# Altium project МЦТР.00010528.00.001.PrjPcb
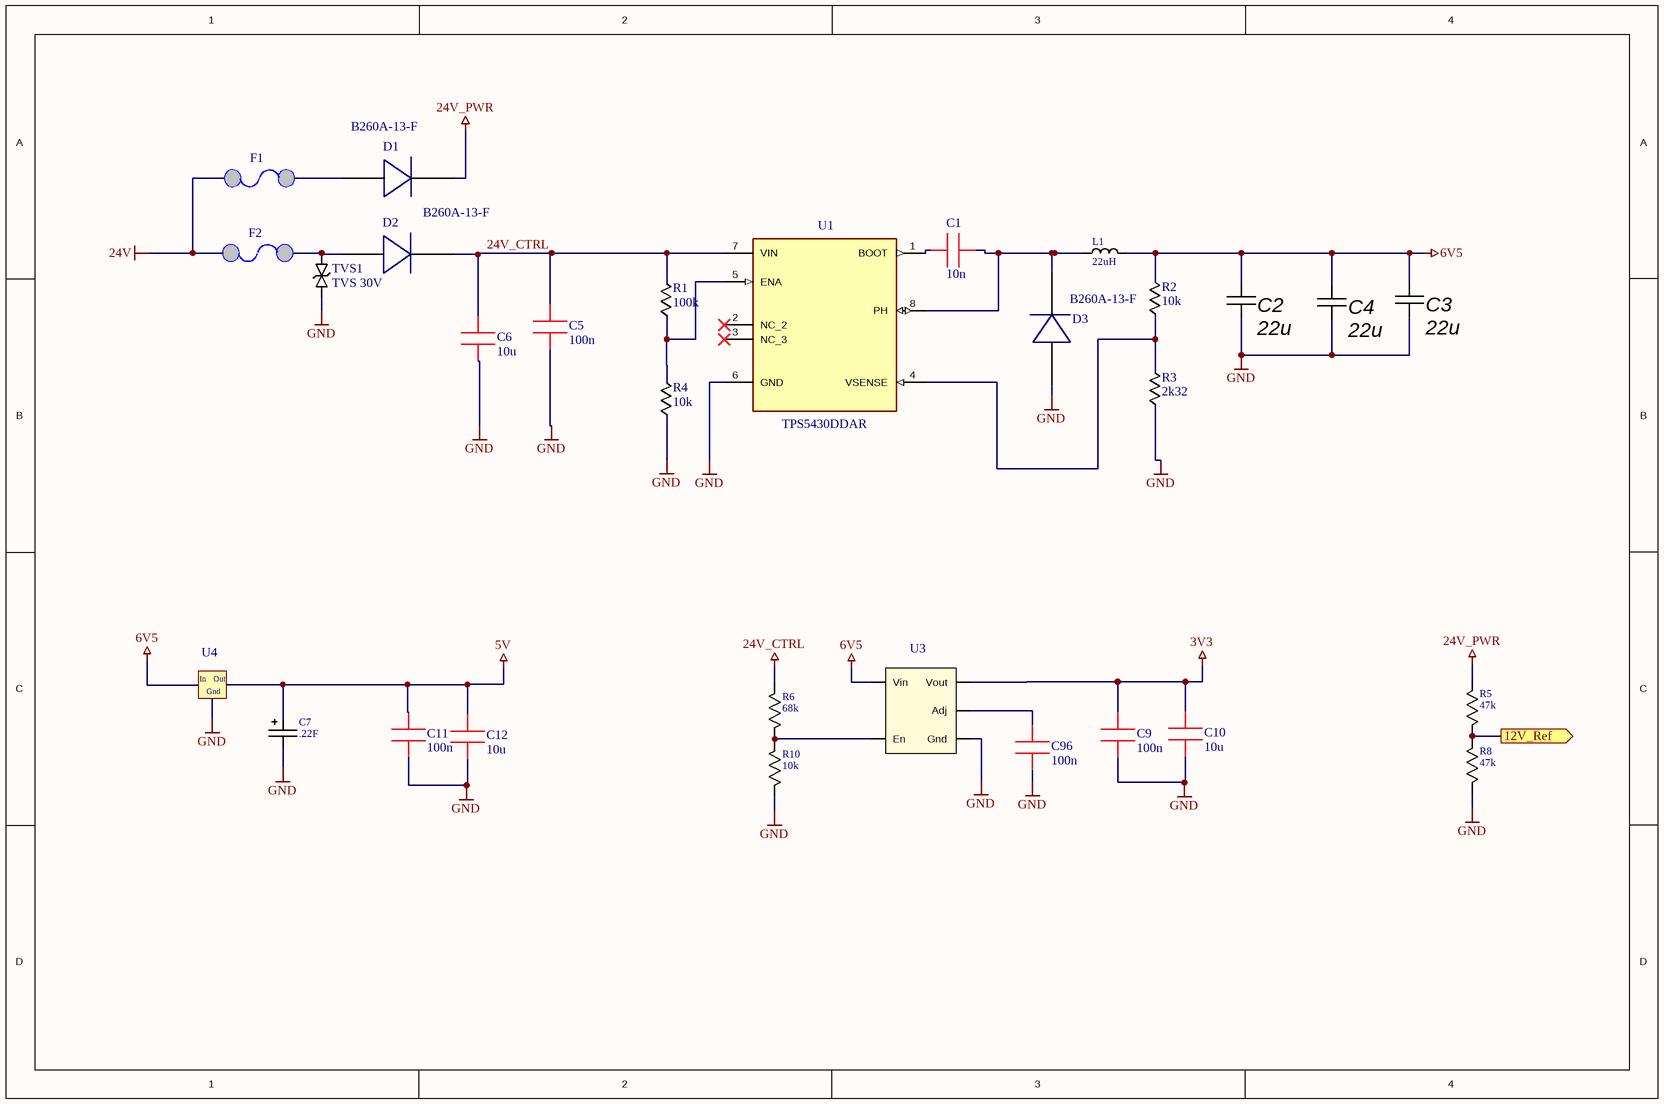
[diagram p0: PSU.SchDoc]
13 sheets, 342 parts. Net scope: global (net labels, ports and power ports of the same name join across sheets).
Board file: 讨倚.00010528.00.001.PcbDoc
Sheets:
  PSU.SchDoc
  MCU.SchDoc
  FRAM.SchDoc
  RTC.SchDoc
  CT Main.SchDoc
  DI 220V DC.SchDoc
  PT100.SchDoc
  4-20.SchDoc
  Encoder NPN.SchDoc
  RS485.SchDoc
  Ethernet.SchDoc
  LEDs.SchDoc
  Plugs.SchDoc

## Sheet PSU.SchDoc
size A4

### Parts
C1  10n  [0603]
C2  22u  [0805]
C3  22u  [0805]
C4  22u  [0805]
C5  100n  [0603]
C6  10u  [1210]
C7  .22F  [Supercap -D20-V]
C9  100n  [0603]
C10  10u  [0603]
C11  100n  [0603]
C12  10u  [0603]
C96  100n  [0603]
D1  B260A-13-F  [DO-214Pol]
D2  B260A-13-F  [DO-214Pol]
D3  B260A-13-F  [DO-214Pol]
F1  Resettable FUSE  [1812]  (value not drawn)
F2  Resettable FUSE  [1812]  (value not drawn)
L1  22uH  [CDRH127]
R1  100k  [0603]
R2  10k  [0603]
R3  2k32  [0603]
R4  10k  [0603]
R5  47k  [RES 0603]
R6  68k  [RES 0603]
R8  47k  [RES 0603]
R10  10k  [RES 0603]
TVS1  TVS 30V  [DO-214AC]
U1  TPS5430DDAR  [SOIC-8 + Thermal Pad]
U3  LDO with Enable Pin  [SOT-23-5]  (value not drawn)
U4  LDO 5V  [SOT223]  (value not drawn)

### Ports
12V_Ref

### Nets
3V3: C9.1 C10.1 U3.5(Vout)
5V: C7.2 C11.1 C12.1 U4.2(OUT)
6V5: C2.2 C3.2 C4.2 L1.2 R2.2 U3.1(Vin) U4.3(IN)
24V: F1.2 F2.2
24V_CTRL: C5.2 C6.1 D2.1 R1.2 R6.1 U1.7(VIN)
24V_PWR: D1.1 R5.1
GND: C2.1 C3.1 C4.1 C5.1 C6.2 C7.1 C9.2 C10.2 C11.2 C12.2 C96.2 D3.2 R3.1 R4.1 R8.2 R10.2 TVS1.2 U1.6(GND) U3.2(Gnd) U4.1(GND)
12V_Ref: R5.2 R8.1 ; port 12V_Ref
NetC1_1: C1.1 D3.1 L1.1 U1.8(PH)
NetC1_2: C1.2 U1.1(BOOT)
NetC96_1: C96.1 U3.4(Adj)
NetD1_2: D1.2 F1.1
NetD2_2: D2.2 F2.1 TVS1.1
NetR1_1: R1.1 R4.2 U1.5(ENA)
NetR2_1: R2.1 R3.2 U1.4(VSENSE)
NetR6_2: R6.2 R10.1 U3.3(En)

Not connected (* = marked no-connect by the designer): U1 2(NC_2)* 3(NC_3)*

### Notes on the sheet
- (in symbol ldo) In; Out; Gnd

### Library data of the parts
C1 = 0603 CAP: CC0603JRX7R9BB103
C2-C4 = Capacitor: CC0805MKX5R6BB226; Value: 100 нФ; Type: Конденсатор ЧИП; Power/Voltage: 50В; Tolerance: 10%; Name: 0805
C5 C9 C11 C96 = 0603 CAP: CC0603KRX7R9BB104
C6 = 1206 Cap: GRM32ER71H106KA12L
C7 = Capacitor Polar: 5R5D10F33V; pin to pad: 1>2 2>1
C10 C12 = 0603 CAP: GRM188R61C106MA73D
F1 F2 = Fuse PTS: MF-MSMF030-2
L1 = Inductor CDRH127: CDRH127/LDNP-220MC; Value: 22uH
R1 = 0603 RES: RC0603FR-07100KL
R2 R4 = 0603 RES: RC0603FR-0710KL
R3 = 0603 RES: RC0603FR-072K32L
R5 R8 = Resistor: RC0603FR-0747KL
R6 = Resistor: RC0603JR-0768KL
R10 = Resistor: RC0603FR-0710KL
TVS1 = TVS: SMAJ30CA
U3 = LM8805: LM8805SF5-3.3
U4 = ldo: LD1117S50CTR

## Sheet MCU.SchDoc
size A4
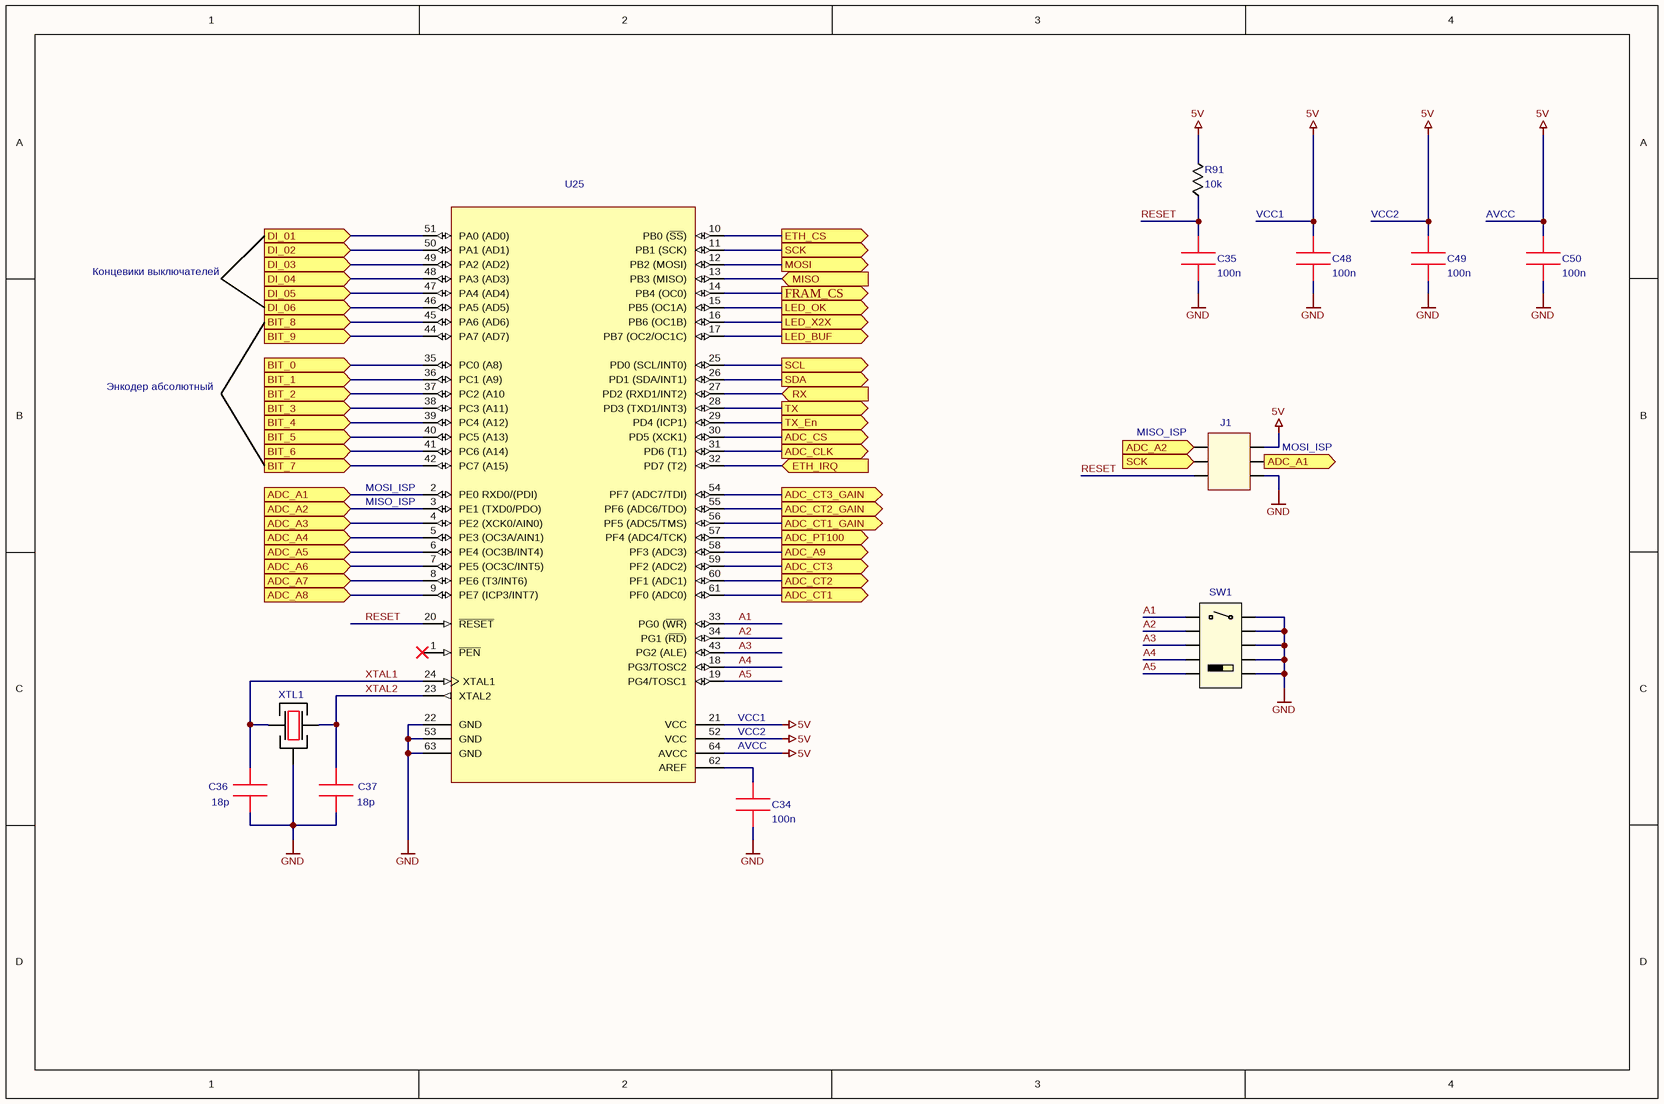
[diagram p1: MCU.SchDoc]

### Parts
C34  100n  [0603]
C35  100n  [0603]
C36  18p  [0603]
C37  18p  [0603]
C48  100n  [0603]
C49  100n  [0603]
C50  100n  [0603]
J1  Pin Line 2x3  [PLD-6 2.54]  (value not drawn)
R91  10k  [0603]
SW1  DIP-Switch 5 Pins  [Switch DIP-5]  (value not drawn)
U25  MCU  [64A_N]  (value not drawn)
XTL1  16.0 MHz  [ABM10]  (value not drawn)

### Ports
ADC_A1, ADC_A2, ADC_A3, ADC_A4, ADC_A5, ADC_A6, ADC_A7, ADC_A8, ADC_A9, ADC_CLK, ADC_CS, ADC_CT1, ADC_CT1_GAIN, ADC_CT2, ADC_CT2_GAIN, ADC_CT3, ADC_CT3_GAIN, ADC_PT100, BIT_0, BIT_1, BIT_2, BIT_3, BIT_4, BIT_5, BIT_6, BIT_7, BIT_8, BIT_9, DI_01, DI_02, DI_03, DI_04, DI_05, DI_06, ETH_CS, ETH_IRQ, FRAM_CS, LED_BUF, LED_OK, LED_X2X, MISO, MOSI, RX, SCK, SCL, SDA, TX, TX_En

### Nets
5V: C48.2 C49.2 C50.2 J1.2 R91.2 U25.21(VCC) U25.52(VCC) U25.64(AVCC)
GND: C34.1 C35.1 C36.1 C37.1 C48.1 C49.1 C50.1 J1.6 SW1.1 SW1.3 SW1.5 SW1.7 SW1.9 U25.22(GND) U25.53(GND) U25.63(GND) XTL1.2
A1: SW1.2 U25.33(PG0_(~{WR}))
A2: SW1.4 U25.34(PG1_(~{RD}))
A3: SW1.6 U25.43(PG2_(ALE))
A4: SW1.8 U25.18(PG3/TOSC2)
A5: SW1.10 U25.19(PG4/TOSC1)
ADC_A1: J1.4 U25.2(PE0_RXD0/(PDI)) ; port ADC_A1
ADC_A2: J1.1 U25.3(PE1_(TXD0/PDO)) ; port ADC_A2
ADC_A3: U25.4(PE2_(XCK0/AIN0)) ; port ADC_A3
ADC_A4: U25.5(PE3_(OC3A/AIN1)) ; port ADC_A4
ADC_A5: U25.6(PE4_(OC3B/INT4)) ; port ADC_A5
ADC_A6: U25.7(PE5_(OC3C/INT5)) ; port ADC_A6
ADC_A7: U25.8(PE6_(T3/INT6)) ; port ADC_A7
ADC_A8: U25.9(PE7_(ICP3/INT7)) ; port ADC_A8
ADC_A9: U25.58(PF3_(ADC3)) ; port ADC_A9
ADC_CLK: U25.31(PD6_(T1)) ; port ADC_CLK
ADC_CS: U25.30(PD5_(XCK1)) ; port ADC_CS
ADC_CT1: U25.61(PF0_(ADC0)) ; port ADC_CT1
ADC_CT1_GAIN: U25.56(PF5_(ADC5/TMS)) ; port ADC_CT1_GAIN
ADC_CT2: U25.60(PF1_(ADC1)) ; port ADC_CT2
ADC_CT2_GAIN: U25.55(PF6_(ADC6/TDO)) ; port ADC_CT2_GAIN
ADC_CT3: U25.59(PF2_(ADC2)) ; port ADC_CT3
ADC_CT3_GAIN: U25.54(PF7_(ADC7/TDI)) ; port ADC_CT3_GAIN
ADC_PT100: U25.57(PF4_(ADC4/TCK)) ; port ADC_PT100
BIT_0: U25.35(PC0_(A8)) ; port BIT_0
BIT_1: U25.36(PC1_(A9)) ; port BIT_1
BIT_2: U25.37(PC2_(A10) ; port BIT_2
BIT_3: U25.38(PC3_(A11)) ; port BIT_3
BIT_4: U25.39(PC4_(A12)) ; port BIT_4
BIT_5: U25.40(PC5_(A13)) ; port BIT_5
BIT_6: U25.41(PC6_(A14)) ; port BIT_6
BIT_7: U25.42(PC7_(A15)) ; port BIT_7
BIT_8: U25.45(PA6_(AD6)) ; port BIT_8
BIT_9: U25.44(PA7_(AD7)) ; port BIT_9
DI_01: U25.51(PA0_(AD0)) ; port DI_01
DI_02: U25.50(PA1_(AD1)) ; port DI_02
DI_03: U25.49(PA2_(AD2)) ; port DI_03
DI_04: U25.48(PA3_(AD3)) ; port DI_04
DI_05: U25.47(PA4_(AD4)) ; port DI_05
DI_06: U25.46(PA5_(AD5)) ; port DI_06
ETH_CS: U25.10(PB0_(~{SS})) ; port ETH_CS
ETH_IRQ: U25.32(PD7_(T2)) ; port ETH_IRQ
FRAM_CS: U25.14(PB4_(OC0)) ; port FRAM_CS
LED_BUF: U25.17(PB7_(OC2/OC1C)) ; port LED_BUF
LED_OK: U25.15(PB5_(OC1A)) ; port LED_OK
LED_X2X: U25.16(PB6_(OC1B)) ; port LED_X2X
MISO: U25.13(PB3_(MISO)) ; port MISO
MOSI: U25.12(PB2_(MOSI)) ; port MOSI
RESET: C35.2 J1.5 R91.1 U25.20(~{RESET})
RX: U25.27(PD2_(RXD1/INT2)) ; port RX
SCK: J1.3 U25.11(PB1_(SCK)) ; port SCK
SCL: U25.25(PD0_(SCL/INT0)) ; port SCL
SDA: U25.26(PD1_(SDA/INT1)) ; port SDA
TX: U25.28(PD3_(TXD1/INT3)) ; port TX
TX_En: U25.29(PD4_(ICP1)) ; port TX_En
XTAL1: C36.2 U25.24(XTAL1) XTL1.1
XTAL2: C37.2 U25.23(XTAL2) XTL1.3
NetC34_2: C34.2 U25.62(AREF)

Not connected (* = marked no-connect by the designer): U25 1(~{PEN})*

### Notes on the sheet
- VCC1
- VCC2
- AVCC
- Концевики выключателей
- Энкодер абсолютный
- (near J1) MISO_ISP
- (near J1) MOSI_ISP
- (near U25) MOSI_ISP
- (near U25) MISO_ISP
- (near U25) VCC1

### Library data of the parts
C34 C35 C48-C50 = 0603 CAP: CC0603KRX7R9BB104
C36 C37 = 0603 CAP: CC0603JRNPO9BN180
J1 = PLD-6
R91 = 0603 RES: RC0603FR-0710KL
SW1 = Switch DIP-5: DIP-Switch NDP-05
U25 = ATmega128A-AU: DatasheetVersion: revH, Feb-2011; PackageVersion: revC, Oct-2010; PackageReference: 64A; PackageDescription: 64-Pin Plastic Thin Profile Quad Flat Pack, 14 x 14 x 1.0 mm Body, 0.8 mm Pitch (TQFP); Code_JEDEC: MS-026-AEB; ComponentLink1Description: Manufacturer URL; ComponentLink1URL: http://www.atmel.com/; ComponentLink2Description: ATmega128A Datasheet; ComponentLink2URL: http://www.atmel.com/dyn/resources/prod_documents/doc8151.pdf; ComponentLink3Description: ATmega128A Summary; ComponentLink3URL: http://www.atmel.com/dyn/resources/prod_documents/8151S.pdf
XTL1 = KX-7: 12.88605

## Sheet FRAM.SchDoc
size A4; PageSetup: Record=PageOptions|CenterHorizontal=True|CenterVertical=True|PrintScale=0.99|XCorrection=1.00|YCorrection=1.00|PrintKind=1|BorderSize=5000000|LeftOffset=0|BottomOffset=0|Orientation=1|PaperLength=1000|PaperWidth=1000|Scale=100|PaperSource=15|PrintQuality=600|MediaType=1|DitherType=10|PrintScaleMode=1|PaperKind=A4|PaperIndex=9
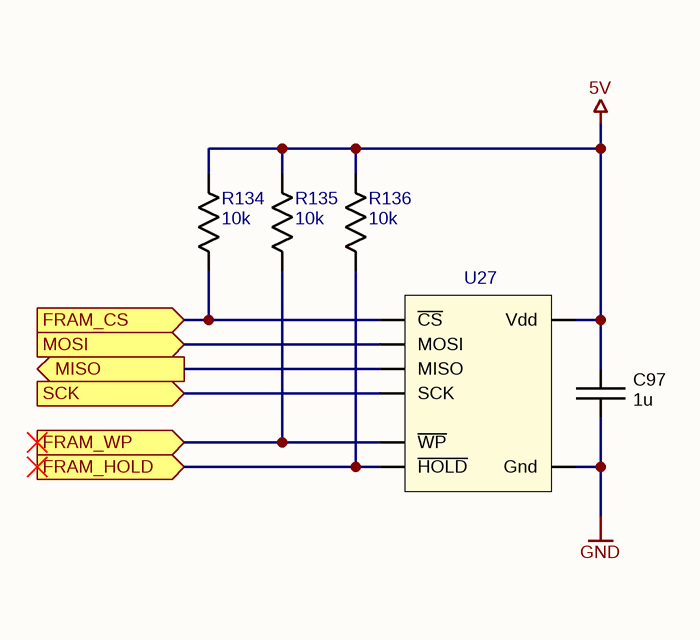
[diagram p2: FRAM.SchDoc]

### Parts
C97  1u  [CAP CER 0603 NP]
R134  10k  [RES 0603]
R135  10k  [RES 0603]
R136  10k  [RES 0603]
U27  FRAM SPI IC  [SOIC-8]  (value not drawn)

### Ports
FRAM_CS, FRAM_HOLD, FRAM_WP, MISO, MOSI, SCK

### Nets
5V: C97.1 R134.2 R135.2 R136.2 U27.8(Vdd)
GND: C97.2 U27.4(Gnd)
FRAM_CS: R134.1 U27.1(~{CS}) ; port FRAM_CS
FRAM_HOLD: R136.1 U27.7(~{HOLD}) ; port FRAM_HOLD
FRAM_WP: R135.1 U27.3(~{WP}) ; port FRAM_WP
MISO: U27.2(MISO) ; port MISO
MOSI: U27.5(MOSI) ; port MOSI
SCK: U27.6(SCK) ; port SCK

### Library data of the parts
C97 = Capacitor: CC0603KRX5R7BB105
R134-R136 = Resistor: RC0603FR-0710KL
U27 = MB85RS64V: MB85RS64VPNF-G-JNERE1

## Sheet RTC.SchDoc
size A4; PageSetup: Record=PageOptions|CenterHorizontal=True|CenterVertical=True|PrintScale=0.99|XCorrection=1.00|YCorrection=1.00|PrintKind=1|BorderSize=5000000|LeftOffset=0|BottomOffset=0|Orientation=1|PaperLength=1000|PaperWidth=1000|Scale=100|PaperSource=15|PrintQuality=600|MediaType=1|DitherType=10|PrintScaleMode=1|PaperKind=A4|PaperIndex=9
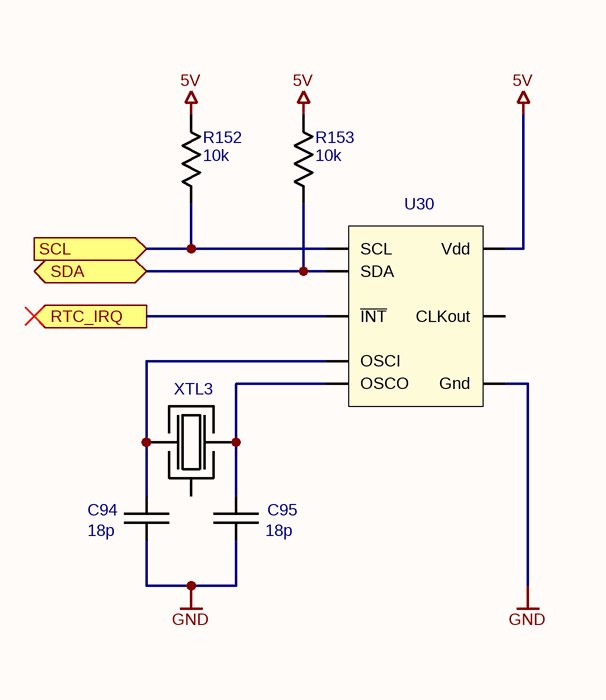
[diagram p3: RTC.SchDoc]

### Parts
C94  18p  [CAP CER 0603 NP]
C95  18p  [CAP CER 0603 NP]
R152  10k  [RES 0603]
R153  10k  [RES 0603]
U30  Real-Time Clock IC  [SOIC-8]  (value not drawn)
XTL3  32.768 kHz  [XTAL KX-327NHT]  (value not drawn)

### Ports
RTC_IRQ, SCL, SDA

### Nets
5V: R152.2 R153.2 U30.8(Vdd)
GND: C94.1 C95.1 U30.4(Gnd)
RTC_IRQ: U30.3(~{INT}) ; port RTC_IRQ
SCL: R152.1 U30.6(SCL) ; port SCL
SDA: R153.1 U30.5(SDA) ; port SDA
NetC94_2: C94.2 U30.1(OSCI) XTL3.1
NetC95_2: C95.2 U30.2(OSCO) XTL3.3

Not connected (* = marked no-connect by the designer): U30 7(CLKout); XTL3 2

### Library data of the parts
C94 C95 = Capacitor: CC0603JRNPO9BN180
R152 R153 = Resistor: RC0603FR-0710KL
U30 = PCF8653: PCF8563T/5,518
XTL3 = Quartz Resonator: 12.87150

## Sheet CT Main.SchDoc
size A3
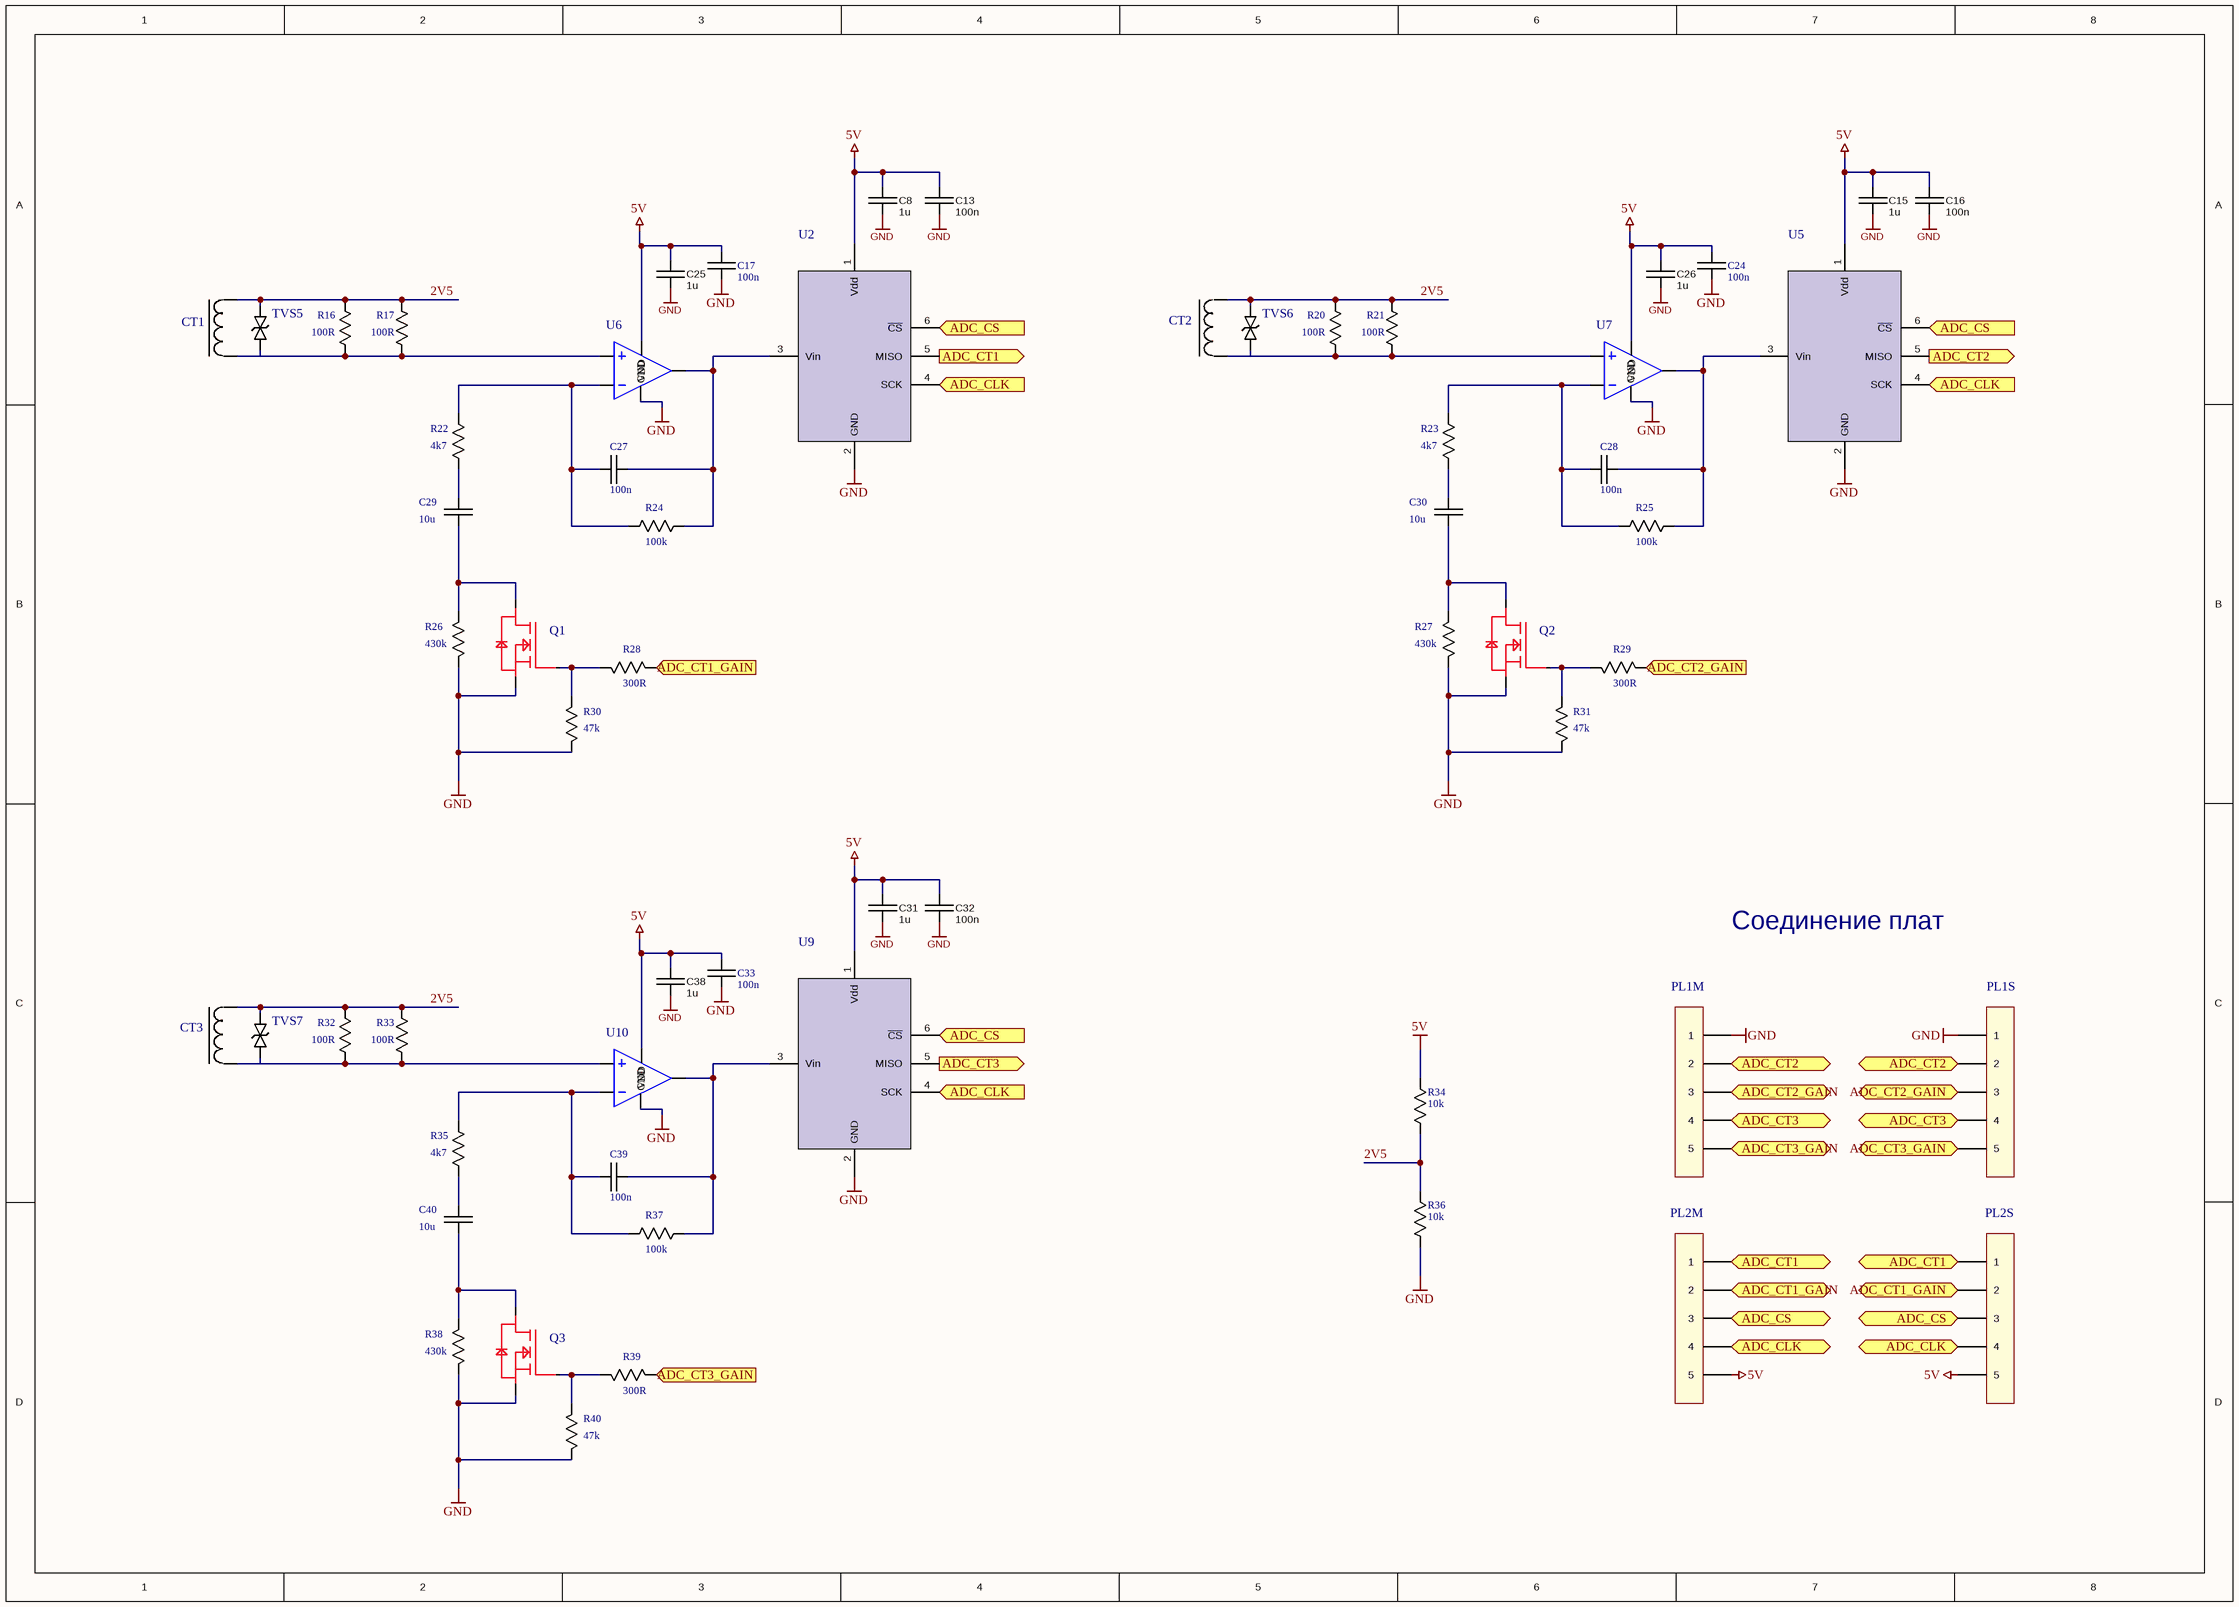
[diagram p4: CT Main.SchDoc]

### Parts
C8  1u  [CAP CER 0603 NP]
C13  100n  [CAP CER 0603 NP]
C15  1u  [CAP CER 0603 NP]
C16  100n  [CAP CER 0603 NP]
C17  100n  [0603]
C24  100n  [0603]
C25  1u  [CAP CER 0603 NP]
C26  1u  [CAP CER 0603 NP]
C27  100n  [0603]
C28  100n  [0603]
C29  10u  [0603]
C30  10u  [0603]
C31  1u  [CAP CER 0603 NP]
C32  100n  [CAP CER 0603 NP]
C33  100n  [0603]
C38  1u  [CAP CER 0603 NP]
C39  100n  [0603]
C40  10u  [0603]
CT1  Current Transformer  [Talema AC1005]  (value not drawn)
CT2  Current Transformer  [Talema AC1005]  (value not drawn)
CT3  Current Transformer  [Talema AC1005]  (value not drawn)
PL1M  Pin Line  [PLS-5 2.54]  (value not drawn)
PL1S  Pin Line  [PLS-5 2.54]  (value not drawn)
PL2M  Pin Line  [PLS-5 2.54]  (value not drawn)
PL2S  Pin Line  [PLS-5 2.54]  (value not drawn)
Q1  MOSFET-N  [SOT23]  (value not drawn)
Q2  MOSFET-N  [SOT23]  (value not drawn)
Q3  MOSFET-N  [SOT23]  (value not drawn)
R16  100R  [1206]
R17  100R  [1206]
R20  100R  [1206]
R21  100R  [1206]
R22  4k7  [0603]
R23  4k7  [0603]
R24  100k  [0603]
R25  100k  [0603]
R26  430k  [0603]
R27  430k  [0603]
R28  300R  [0603]
R29  300R  [0603]
R30  47k  [0603]
R31  47k  [0603]
R32  100R  [1206]
R33  100R  [1206]
R34  10k  [0603]
R35  4k7  [0603]
R36  10k  [0603]
R37  100k  [0603]
R38  430k  [0603]
R39  300R  [0603]
R40  47k  [0603]
TVS5  TVS 5V  [DO-214AC]  (value not drawn)
TVS6  TVS 5V  [DO-214AC]  (value not drawn)
TVS7  TVS 5V  [DO-214AC]  (value not drawn)
U2  SAR ADC  [SOT23 - 6]  (value not drawn)
U5  SAR ADC  [SOT23 - 6]  (value not drawn)
U6  TS321ILT  [SOT235]  (value not drawn)
U7  TS321ILT  [SOT235]  (value not drawn)
U9  SAR ADC  [SOT23 - 6]  (value not drawn)
U10  TS321ILT  [SOT235]  (value not drawn)

### Ports
ADC_CLK, ADC_CS, ADC_CT1, ADC_CT1_GAIN, ADC_CT2, ADC_CT2_GAIN, ADC_CT3, ADC_CT3_GAIN

### Nets
5V: C8.1 C13.2 C15.1 C16.2 C17.2 C24.2 C25.1 C26.1 C31.1 C32.2 C33.2 C38.1 PL2M.5 PL2S.5 R34.1 U2.1(Vdd) U5.1(Vdd) U6.5(VDD) U7.5(VDD) U9.1(Vdd) U10.5(VDD)
GND: C8.2 C13.1 C15.2 C16.1 C17.1 C24.1 C25.2 C26.2 C31.2 C32.1 C33.1 C38.2 PL1M.1 PL1S.1 Q1.2 Q2.2 Q3.2 R26.1 R27.1 R30.1 R31.1 R36.2 R38.1 R40.1 U2.2(GND) U5.2(GND) U6.2(GND) U7.2(GND) U9.2(GND) U10.2(GND)
2V5: CT1.2 CT2.2 CT3.2 R16.2 R17.2 R20.2 R21.2 R32.2 R33.2 R34.2 R36.1 TVS5.2 TVS6.2 TVS7.2
ADC_CLK: PL2M.4 PL2S.4 U2.4(SCK) U5.4(SCK) U9.4(SCK) ; port ADC_CLK
ADC_CS: PL2M.3 PL2S.3 U2.6(~{CS}) U5.6(~{CS}) U9.6(~{CS}) ; port ADC_CS
ADC_CT1: PL2M.1 PL2S.1 U2.5(MISO) ; port ADC_CT1
ADC_CT1_GAIN: PL2M.2 PL2S.2 R28.1 ; port ADC_CT1_GAIN
ADC_CT2: PL1M.2 PL1S.2 U5.5(MISO) ; port ADC_CT2
ADC_CT2_GAIN: PL1M.3 PL1S.3 R29.1 ; port ADC_CT2_GAIN
ADC_CT3: PL1M.4 PL1S.4 U9.5(MISO) ; port ADC_CT3
ADC_CT3_GAIN: PL1M.5 PL1S.5 R39.1 ; port ADC_CT3_GAIN
NetC27_1: C27.1 R22.2 R24.1 U6.4(-IN)
NetC27_2: C27.2 R24.2 U2.3(Vin) U6.1(OUT)
NetC28_1: C28.1 R23.2 R25.1 U7.4(-IN)
NetC28_2: C28.2 R25.2 U5.3(Vin) U7.1(OUT)
NetC29_1: C29.1 Q1.3 R26.2
NetC29_2: C29.2 R22.1
NetC30_1: C30.1 Q2.3 R27.2
NetC30_2: C30.2 R23.1
NetC39_1: C39.1 R35.2 R37.1 U10.4(-IN)
NetC39_2: C39.2 R37.2 U9.3(Vin) U10.1(OUT)
NetC40_1: C40.1 Q3.3 R38.2
NetC40_2: C40.2 R35.1
NetCT1_1: CT1.1 R16.1 R17.1 TVS5.1 U6.3(+IN)
NetCT2_1: CT2.1 R20.1 R21.1 TVS6.1 U7.3(+IN)
NetCT3_1: CT3.1 R32.1 R33.1 TVS7.1 U10.3(+IN)
NetQ1_1: Q1.1 R28.2 R30.2
NetQ2_1: Q2.1 R29.2 R31.2
NetQ3_1: Q3.1 R39.2 R40.2

### Notes on the sheet
- Соединение плат

### Library data of the parts
C8 C15 C25 C26 C31 C38 = Capacitor: CC0603KRX5R7BB105
C13 C16 C17 C24 C27 C28 C32 C33 C39 = Capacitor: CC0603KRX7R9BB104
C29 C30 C40 = Capacitor: GRM188R61C106MA73D
CT1-CT3 = Current Trans: AC-1005
PL1M PL1S PL2M PL2S = PLS-5: PLS-5 2.54
Q1-Q3 = IRLML: IRLML2502TR
R16 R17 R20 R21 R32 R33 = Resistor: RT1206BRD07100RL
R22 R23 R35 = Resistor: RC0603FR-074K7L
R24 R25 R37 = Resistor: RC0603FR-07100KL
R26 R27 R38 = Resistor: RC0603FR-07430KL
R28 R29 R39 = Resistor: RC0603FR-07300RL
R30 R31 R40 = Resistor: RC0603FR-0747KL
R34 R36 = Resistor: RC0603FR-0710KL
TVS5-TVS7 = SMAJ5.0CA
U2 U5 U9 = ADC121: ADC121S021CIMF
U6 U7 U10 = OPAMP

## Sheet DI 220V DC.SchDoc
size A4
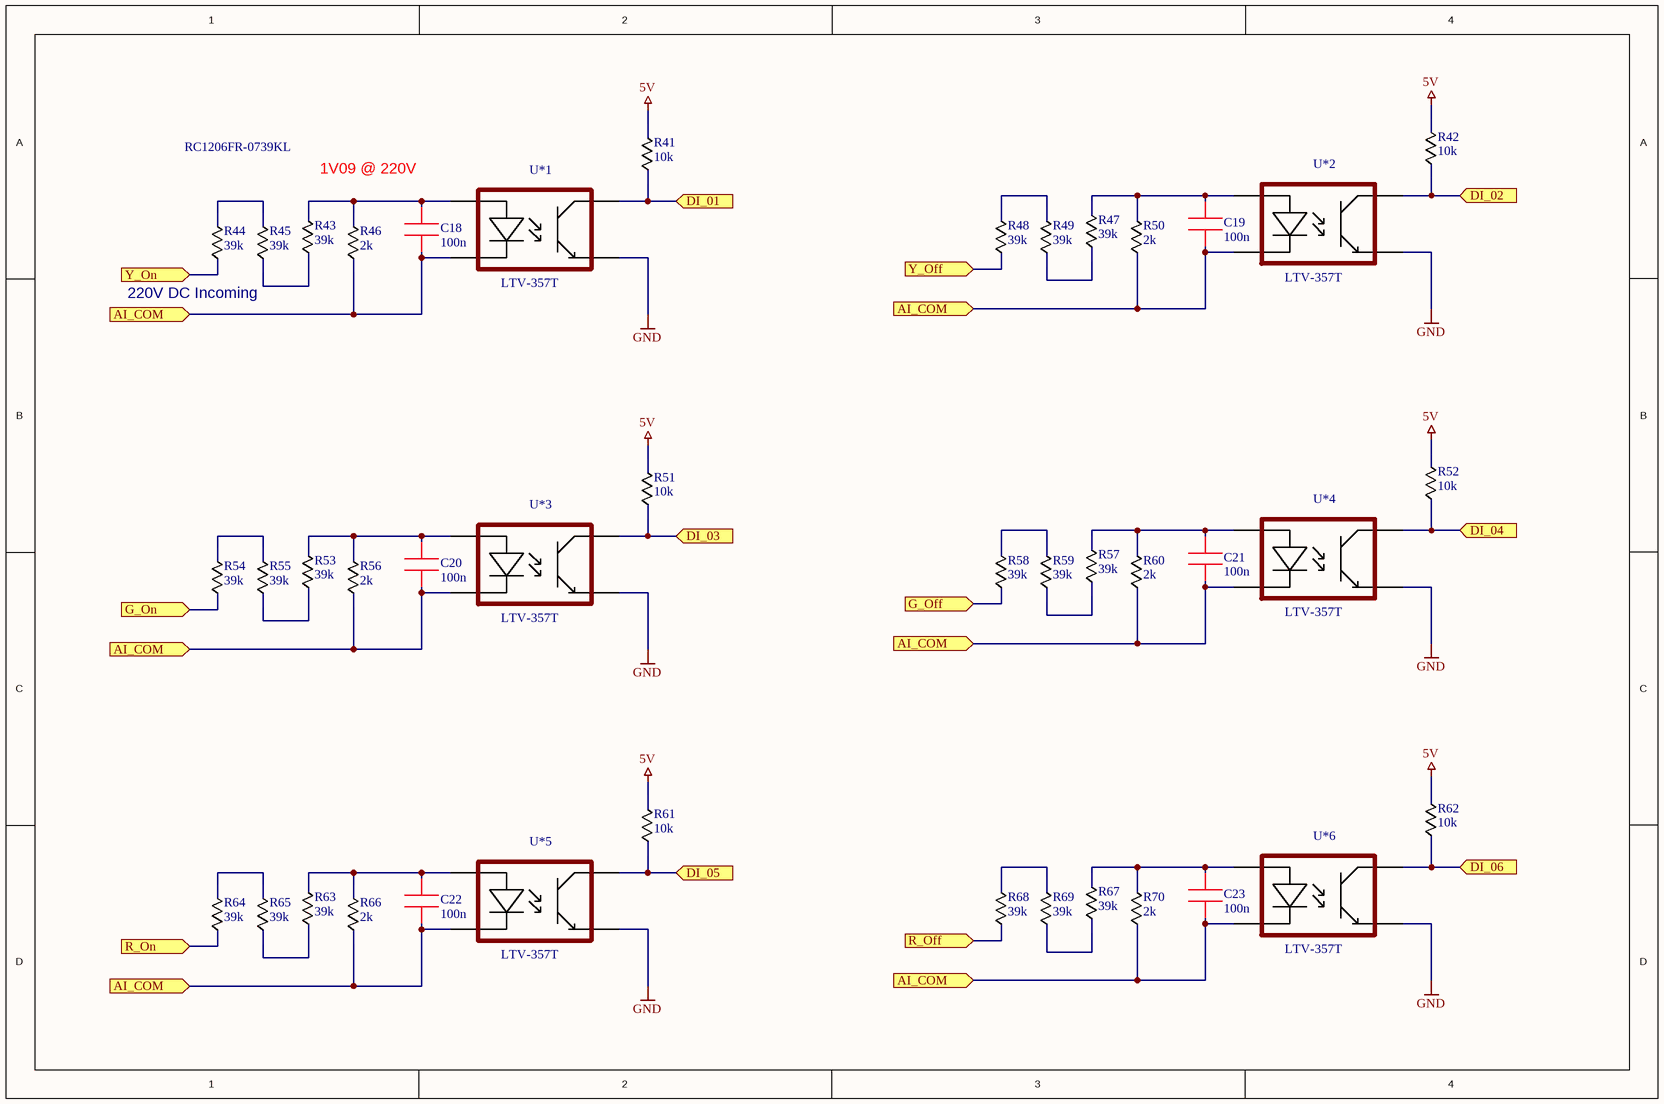
[diagram p5: DI 220V DC.SchDoc]

### Parts
C18  100n  [0603]
C19  100n  [0603]
C20  100n  [0603]
C21  100n  [0603]
C22  100n  [0603]
C23  100n  [0603]
R41  10k  [0603]
R42  10k  [0603]
R43  39k  [1206]
R44  39k  [1206]
R45  39k  [1206]
R46  2k  [1206]
R47  39k  [1206]
R48  39k  [1206]
R49  39k  [1206]
R50  2k  [1206]
R51  10k  [0603]
R52  10k  [0603]
R53  39k  [1206]
R54  39k  [1206]
R55  39k  [1206]
R56  2k  [1206]
R57  39k  [1206]
R58  39k  [1206]
R59  39k  [1206]
R60  2k  [1206]
R61  10k  [0603]
R62  10k  [0603]
R63  39k  [1206]
R64  39k  [1206]
R65  39k  [1206]
R66  2k  [1206]
R67  39k  [1206]
R68  39k  [1206]
R69  39k  [1206]
R70  2k  [1206]
U*1  LTV-357T  [SOP-4]
U*2  LTV-357T  [SOP-4]
U*3  LTV-357T  [SOP-4]
U*4  LTV-357T  [SOP-4]
U*5  LTV-357T  [SOP-4]
U*6  LTV-357T  [SOP-4]

### Ports
AI_COM, DI_01, DI_02, DI_03, DI_04, DI_05, DI_06, G_Off, G_On, R_Off, R_On, Y_Off, Y_On

### Nets
5V: R41.2 R42.2 R51.2 R52.2 R61.2 R62.2
GND: U*1.Emmiter(E) U*2.Emmiter(E) U*3.Emmiter(E) U*4.Emmiter(E) U*5.Emmiter(E) U*6.Emmiter(E)
AI_COM: C18.1 C19.1 C20.1 C21.1 C22.1 C23.1 R46.1 R50.1 R56.1 R60.1 R66.1 R70.1 U*1.Cathode(C) U*2.Cathode(C) U*3.Cathode(C) U*4.Cathode(C) U*5.Cathode(C) U*6.Cathode(C) ; port AI_COM
DI_01: R41.1 U*1.Collector(C) ; port DI_01
DI_02: R42.1 U*2.Collector(C) ; port DI_02
DI_03: R51.1 U*3.Collector(C) ; port DI_03
DI_04: R52.1 U*4.Collector(C) ; port DI_04
DI_05: R61.1 U*5.Collector(C) ; port DI_05
DI_06: R62.1 U*6.Collector(C) ; port DI_06
G_Off: R58.1 ; port G_Off
G_On: R54.1 ; port G_On
R_Off: R68.1 ; port R_Off
R_On: R64.1 ; port R_On
Y_Off: R48.1 ; port Y_Off
Y_On: R44.1 ; port Y_On
NetC18_2: C18.2 R43.2 R46.2 U*1.Anode(A)
NetC19_2: C19.2 R47.2 R50.2 U*2.Anode(A)
NetC20_2: C20.2 R53.2 R56.2 U*3.Anode(A)
NetC21_2: C21.2 R57.2 R60.2 U*4.Anode(A)
NetC22_2: C22.2 R63.2 R66.2 U*5.Anode(A)
NetC23_2: C23.2 R67.2 R70.2 U*6.Anode(A)
NetR43_1: R43.1 R45.1
NetR44_2: R44.2 R45.2
NetR47_1: R47.1 R49.1
NetR48_2: R48.2 R49.2
NetR53_1: R53.1 R55.1
NetR54_2: R54.2 R55.2
NetR57_1: R57.1 R59.1
NetR58_2: R58.2 R59.2
NetR63_1: R63.1 R65.1
NetR64_2: R64.2 R65.2
NetR67_1: R67.1 R69.1
NetR68_2: R68.2 R69.2

### Notes on the sheet
- RC1206FR-0739KL
- 1V09 @ 220V
- 220V DC Incoming

### Library data of the parts
C18-C23 = 0603 CAP: CC0603KRX7R9BB104
R41 R42 R51 R52 R61 R62 = 0603 RES: RC0603FR-0710KL
R43-R45 R47-R49 R53-R55 R57-R59 R63-R65 R67-R69 = 1206 R: RC1206FR-0739KL
R46 R50 R56 R60 R66 R70 = 1206 R: RC1206FR-072KL
U*1-U*6 = LTV-357T: pin to pad: Anode>1 Cathode>2 Collector>4 Emmiter>3

## Sheet PT100.SchDoc
size A4; PageSetup: Record=PageOptions|CenterHorizontal=True|CenterVertical=True|PrintScale=0.99|XCorrection=1.00|YCorrection=1.00|PrintKind=1|BorderSize=5000000|LeftOffset=0|BottomOffset=0|Orientation=1|PaperLength=1000|PaperWidth=1000|Scale=100|PaperSource=15|PrintQuality=600|MediaType=1|DitherType=10|PrintScaleMode=1|PaperKind=A4|PaperIndex=9
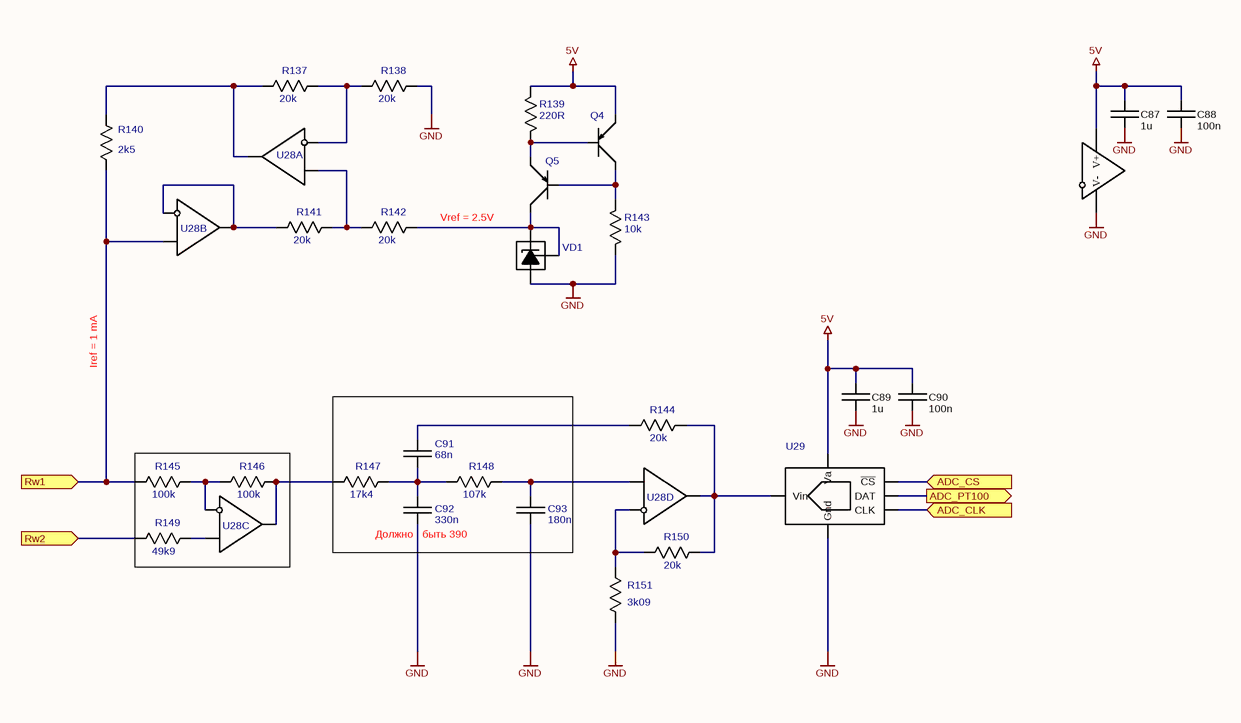
[diagram p6: PT100.SchDoc]

### Parts
C87  1u  [CAP CER 0603 NP]
C88  100n  [CAP CER 0603 NP]
C89  1u  [CAP CER 0603 NP]
C90  100n  [CAP CER 0603 NP]
C91  68n  [CAP CER 0603 NP]
C92  330n  [CAP CER 0603 NP]
C93  180n  [CAP CER 0603 NP]
Q4  PNP Bipolar Transistor  [SOT-23]  (value not drawn)
Q5  PNP Bipolar Transistor  [SOT-23]  (value not drawn)
R137  20k  [RES 0603]
R138  20k  [RES 0603]
R139  220R  [RES 0603]
R140  2k5  [RES 0603]
R141  20k  [RES 0603]
R142  20k  [RES 0603]
R143  10k  [RES 0603]
R144  20k  [RES 0603]
R145  100k  [RES 0603]
R146  100k  [RES 0603]
R147  17k4  [RES 0603]
R148  107k  [RES 0603]
R149  49k9  [RES 0603]
R150  20k  [RES 0603]
R151  3k09  [RES 0603]
U28  OpAmp x4 Small  [SOIC-14]  (value not drawn)  (parts A,B,C,D,E of 5)
U29  SAR ADC  [SOT-23-6]  (value not drawn)
VD1  Zenner Diode Adjustable  [SOT-23]  (value not drawn)

### Blocks framed on the sheet
Должно   быть 390: C91-C93 R147 R148

### Ports
ADC_CLK, ADC_CS, ADC_PT100, Rw1, Rw2

### Nets
5V: C87.1 C88.1 C89.1 C90.1 Q4.2(E) R139.2 U28.13(V+) U29.1(Va)
GND: C87.2 C88.2 C89.2 C90.2 C92.1 C93.1 R138.2 R143.1 R151.1 U28.14(V-) U29.2(Gnd) VD1.1(A)
ADC_CLK: U29.4(CLK) ; port ADC_CLK
ADC_CS: U29.6(~{CS}) ; port ADC_CS
ADC_PT100: U29.5(DAT) ; port ADC_PT100
Rw1: R140.1 R145.1 U28.4(+IN) ; port Rw1
Rw2: R149.1 ; port Rw2
NetC91_1: C91.1 C92.2 R147.2 R148.1
NetC91_2: C91.2 R144.1
NetC93_2: C93.2 R148.2 U28.10(+IN)
NetQ4_1: Q4.1(B) Q5.2(E) R139.1
NetQ4_3: Q4.3(C) Q5.1(B) R143.2
NetQ5_3: Q5.3(C) R142.2 VD1.2(C) VD1.3(Ref)
NetR137_1: R137.1 R140.2 U28.3(OUT1)
NetR137_2: R137.2 R138.1 U28.2(-IN1)
NetR141_1: R141.1 U28.5(-IN) U28.6(OUT)
NetR141_2: R141.2 R142.1 U28.1(+IN1)
NetR144_2: R144.2 R150.2 U28.12(OUT) U29.3(Vin)
NetR145_2: R145.2 R146.1 U28.8(-IN)
NetR146_2: R146.2 R147.1 U28.9(OUT)
NetR149_2: R149.2 U28.7(+IN)
NetR150_1: R150.1 R151.2 U28.11(-IN)

### Notes on the sheet
- Vref = 2.5V
- Iref = 1 mA

### Library data of the parts
C87 C89 = Capacitor: CC0603KRX5R7BB105
C88 C90 = Capacitor: CC0603KRX7R9BB104
C91 = Capacitor: CC0603JRX7R9BB683
C92 = Capacitor: CC0603KRX5R8BB334
C93 = Capacitor: GRM188R71E184KA88D
Q4 Q5 = Bipolar PNP: BC857
R137 R138 R141 R142 = Resistor: RT0603BRD0720KL
R139 = Resistor: RT0603BRD07220RL
R140 = Resistor: AR03BTC2501
R143 = Resistor: RT0603BRD0710KL
R144 R150 = Resistor: RC0603FR-0720KL
R145 R146 = Resistor: RC0603FR-07100KL
R147 = Resistor: RC0603FR-0717K4L
R148 = Resistor: RC0603FR-07107KL
R149 = Resistor: RC0603FR-0749K9L
R151 = Resistor: RC0603FR-073K09L
U28 = OpAmp x4 Small: LMV324IDT; pin to pad: 1>3 3>1 4>5 5>6 6>7 7>10 8>9 9>8 10>12 11>13 12>14 13>11 14>4
U29 = ADC121: ADC121S021CIMF
VD1 = TL431: TL431ACDBZR; pin to pad: 1>3 2>1 3>2

## Sheet 4-20.SchDoc
size A3
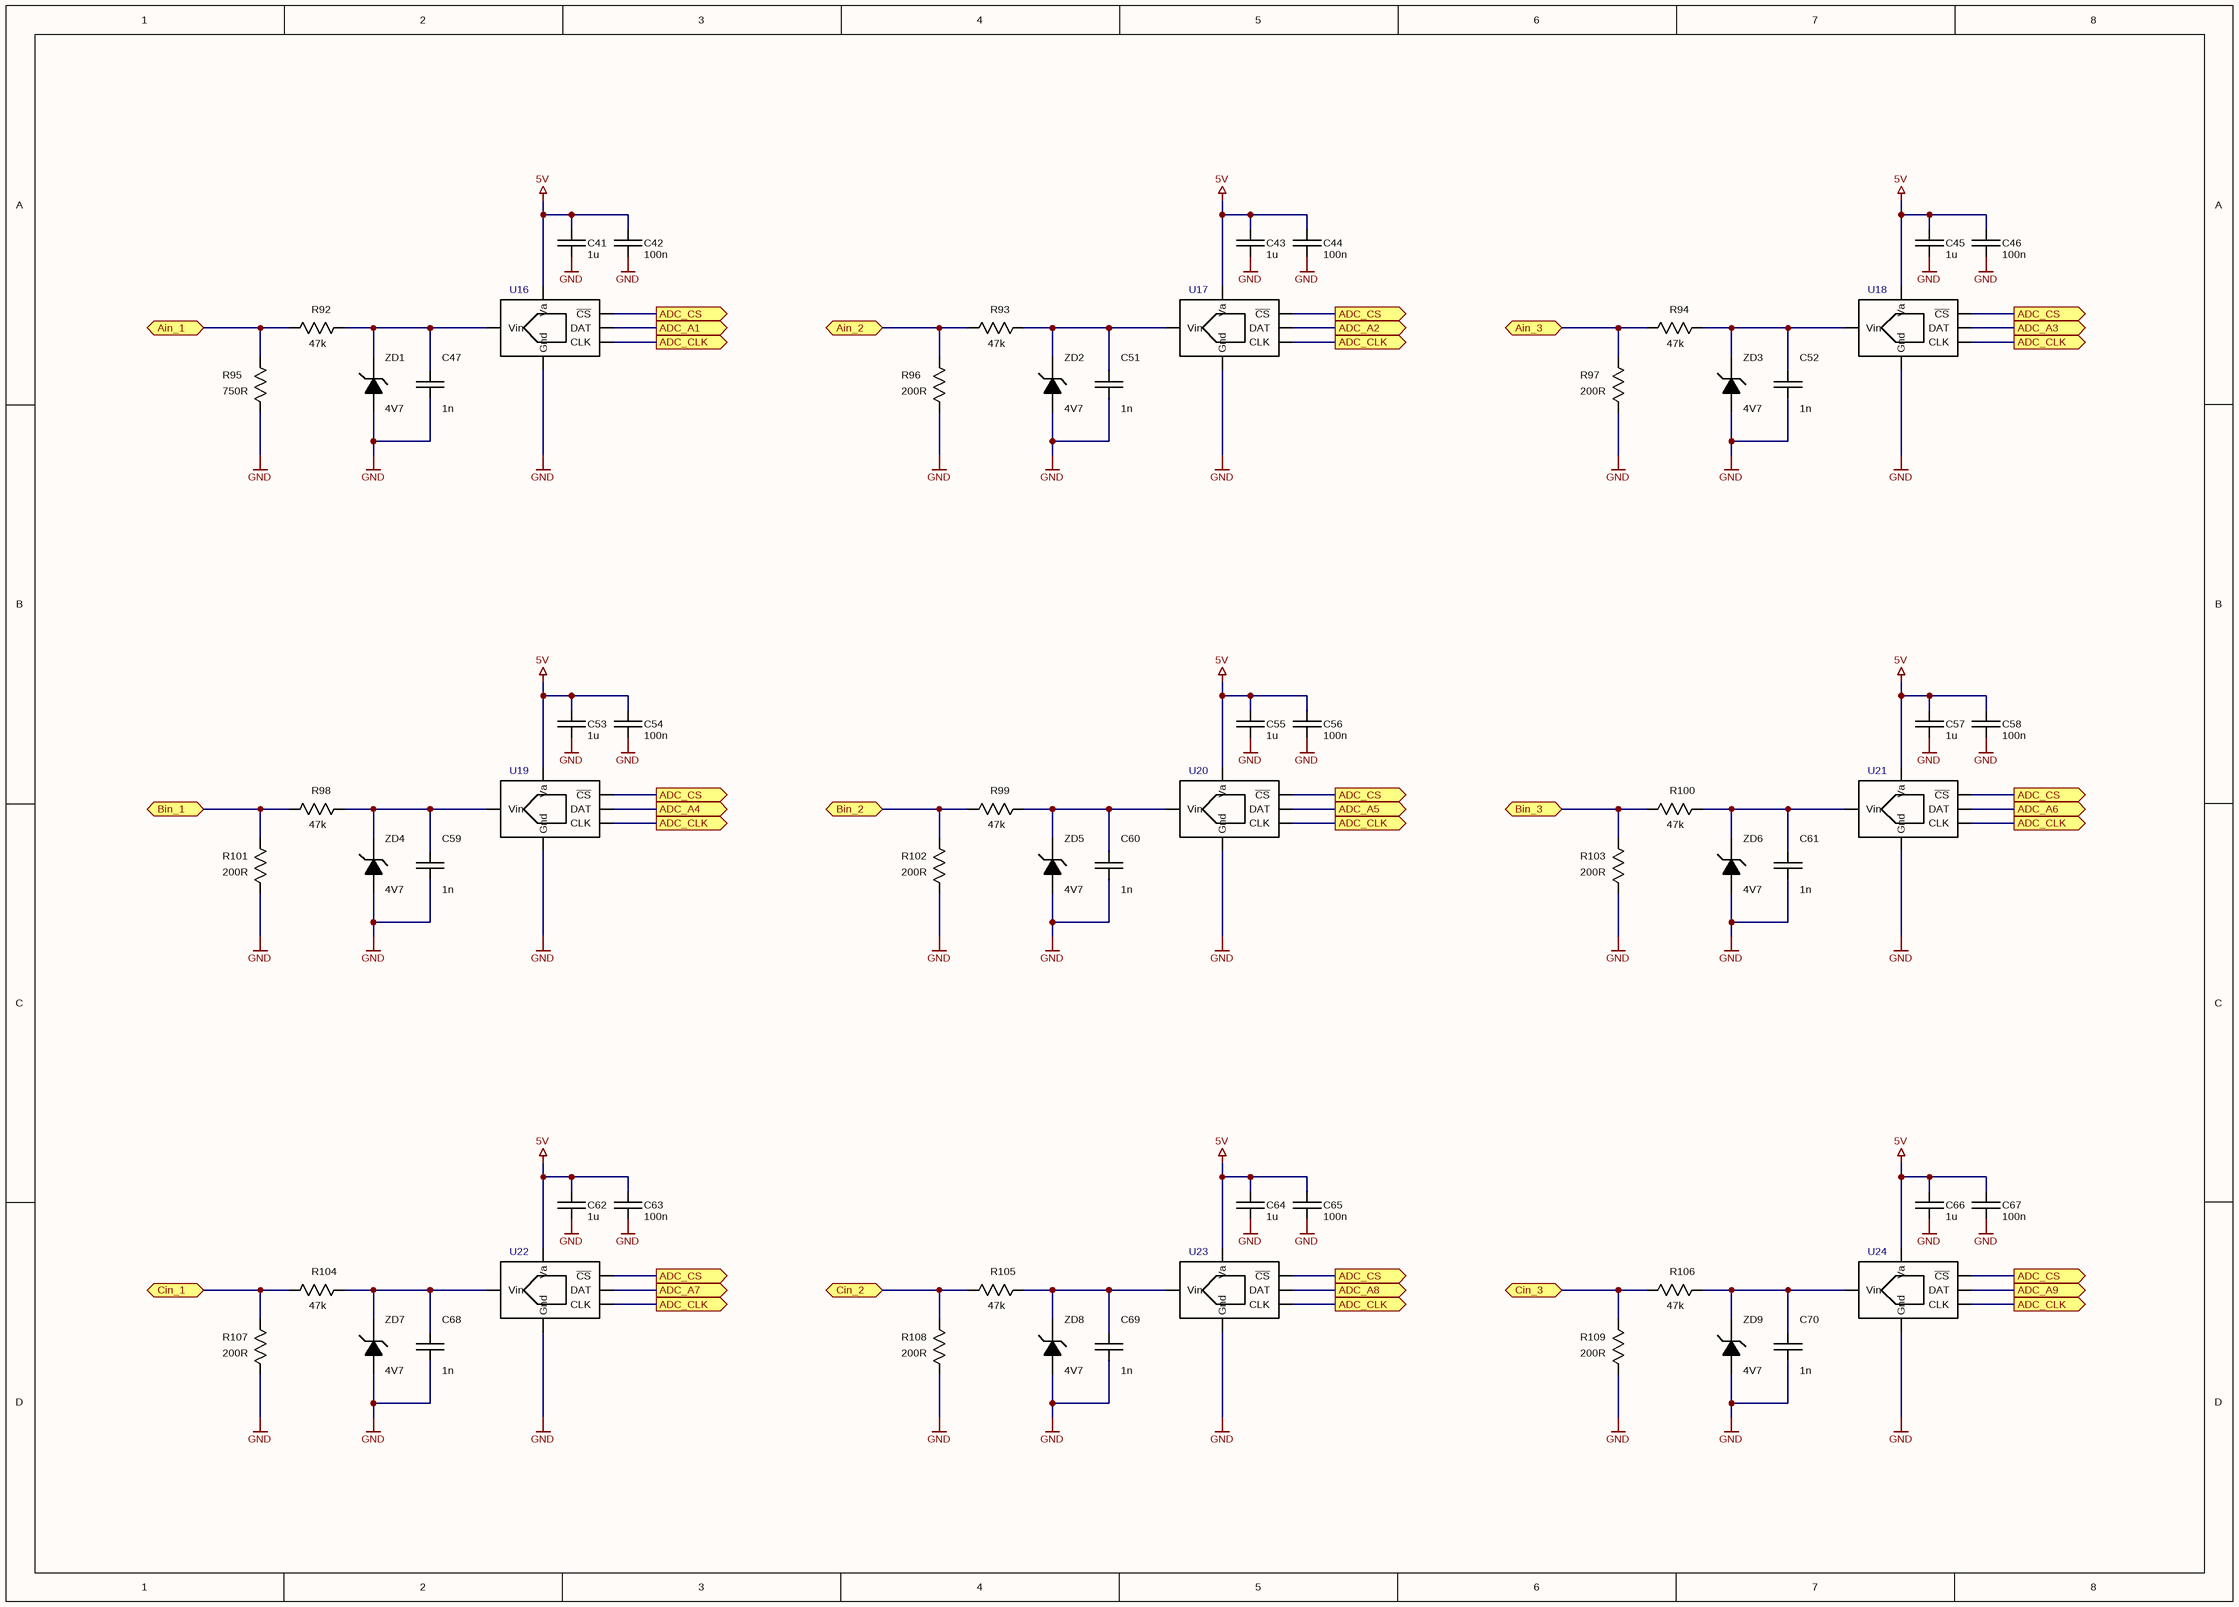
[diagram p7: 4-20.SchDoc]

### Parts
C41  1u  [CAP CER 0603 NP]
C42  100n  [CAP CER 0603 NP]
C43  1u  [CAP CER 0603 NP]
C44  100n  [CAP CER 0603 NP]
C45  1u  [CAP CER 0603 NP]
C46  100n  [CAP CER 0603 NP]
C47  1n  [CAP CER 0603 NP]
C51  1n  [CAP CER 0603 NP]
C52  1n  [CAP CER 0603 NP]
C53  1u  [CAP CER 0603 NP]
C54  100n  [CAP CER 0603 NP]
C55  1u  [CAP CER 0603 NP]
C56  100n  [CAP CER 0603 NP]
C57  1u  [CAP CER 0603 NP]
C58  100n  [CAP CER 0603 NP]
C59  1n  [CAP CER 0603 NP]
C60  1n  [CAP CER 0603 NP]
C61  1n  [CAP CER 0603 NP]
C62  1u  [CAP CER 0603 NP]
C63  100n  [CAP CER 0603 NP]
C64  1u  [CAP CER 0603 NP]
C65  100n  [CAP CER 0603 NP]
C66  1u  [CAP CER 0603 NP]
C67  100n  [CAP CER 0603 NP]
C68  1n  [CAP CER 0603 NP]
C69  1n  [CAP CER 0603 NP]
C70  1n  [CAP CER 0603 NP]
R92  47k  [RES 0603]
R93  47k  [RES 0603]
R94  47k  [RES 0603]
R95  750R  [RES 1210]
R96  200R  [RES 1210]
R97  200R  [RES 1210]
R98  47k  [RES 0603]
R99  47k  [RES 0603]
R100  47k  [RES 0603]
R101  200R  [RES 1210]
R102  200R  [RES 1210]
R103  200R  [RES 1210]
R104  47k  [RES 0603]
R105  47k  [RES 0603]
R106  47k  [RES 0603]
R107  200R  [RES 1210]
R108  200R  [RES 1210]
R109  200R  [RES 1210]
U16  SAR ADC  [SOT-23-6]  (value not drawn)
U17  SAR ADC  [SOT-23-6]  (value not drawn)
U18  SAR ADC  [SOT-23-6]  (value not drawn)
U19  SAR ADC  [SOT-23-6]  (value not drawn)
U20  SAR ADC  [SOT-23-6]  (value not drawn)
U21  SAR ADC  [SOT-23-6]  (value not drawn)
U22  SAR ADC  [SOT-23-6]  (value not drawn)
U23  SAR ADC  [SOT-23-6]  (value not drawn)
U24  SAR ADC  [SOT-23-6]  (value not drawn)
ZD1  4V7  [SOD323 (SC-76) - Reflow]
ZD2  4V7  [SOD323 (SC-76) - Reflow]
ZD3  4V7  [SOD323 (SC-76) - Reflow]
ZD4  4V7  [SOD323 (SC-76) - Reflow]
ZD5  4V7  [SOD323 (SC-76) - Reflow]
ZD6  4V7  [SOD323 (SC-76) - Reflow]
ZD7  4V7  [SOD323 (SC-76) - Reflow]
ZD8  4V7  [SOD323 (SC-76) - Reflow]
ZD9  4V7  [SOD323 (SC-76) - Reflow]

### Ports
ADC_A1, ADC_A2, ADC_A3, ADC_A4, ADC_A5, ADC_A6, ADC_A7, ADC_A8, ADC_A9, ADC_CLK, ADC_CS, Ain_1, Ain_2, Ain_3, Bin_1, Bin_2, Bin_3, Cin_1, Cin_2, Cin_3

### Nets
5V: C41.1 C42.2 C43.1 C44.2 C45.1 C46.2 C53.1 C54.2 C55.1 C56.2 C57.1 C58.2 C62.1 C63.2 C64.1 C65.2 C66.1 C67.2 U16.1(Va) U17.1(Va) U18.1(Va) U19.1(Va) U20.1(Va) U21.1(Va) U22.1(Va) U23.1(Va) U24.1(Va)
GND: C41.2 C42.1 C43.2 C44.1 C45.2 C46.1 C47.1 C51.1 C52.1 C53.2 C54.1 C55.2 C56.1 C57.2 C58.1 C59.1 C60.1 C61.1 C62.2 C63.1 C64.2 C65.1 C66.2 C67.1 C68.1 C69.1 C70.1 R95.1 R96.1 R97.1 R101.1 R102.1 R103.1 R107.1 R108.1 R109.1 U16.2(Gnd) U17.2(Gnd) U18.2(Gnd) U19.2(Gnd) U20.2(Gnd) U21.2(Gnd) U22.2(Gnd) U23.2(Gnd) U24.2(Gnd) ZD1.1(A) ZD2.1(A) ZD3.1(A) ZD4.1(A) ZD5.1(A) ZD6.1(A) ZD7.1(A) ZD8.1(A) ZD9.1(A)
ADC_A1: U16.5(DAT) ; port ADC_A1
ADC_A2: U17.5(DAT) ; port ADC_A2
ADC_A3: U18.5(DAT) ; port ADC_A3
ADC_A4: U19.5(DAT) ; port ADC_A4
ADC_A5: U20.5(DAT) ; port ADC_A5
ADC_A6: U21.5(DAT) ; port ADC_A6
ADC_A7: U22.5(DAT) ; port ADC_A7
ADC_A8: U23.5(DAT) ; port ADC_A8
ADC_A9: U24.5(DAT) ; port ADC_A9
ADC_CLK: U16.4(CLK) U17.4(CLK) U18.4(CLK) U19.4(CLK) U20.4(CLK) U21.4(CLK) U22.4(CLK) U23.4(CLK) U24.4(CLK) ; port ADC_CLK
ADC_CS: U16.6(~{CS}) U17.6(~{CS}) U18.6(~{CS}) U19.6(~{CS}) U20.6(~{CS}) U21.6(~{CS}) U22.6(~{CS}) U23.6(~{CS}) U24.6(~{CS}) ; port ADC_CS
Ain_1: R92.2 R95.2 ; port Ain_1
Ain_2: R93.2 R96.2 ; port Ain_2
Ain_3: R94.2 R97.2 ; port Ain_3
Bin_1: R98.2 R101.2 ; port Bin_1
Bin_2: R99.2 R102.2 ; port Bin_2
Bin_3: R100.2 R103.2 ; port Bin_3
Cin_1: R104.2 R107.2 ; port Cin_1
Cin_2: R105.2 R108.2 ; port Cin_2
Cin_3: R106.2 R109.2 ; port Cin_3
NetC47_2: C47.2 R92.1 U16.3(Vin) ZD1.2(C)
NetC51_2: C51.2 R93.1 U17.3(Vin) ZD2.2(C)
NetC52_2: C52.2 R94.1 U18.3(Vin) ZD3.2(C)
NetC59_2: C59.2 R98.1 U19.3(Vin) ZD4.2(C)
NetC60_2: C60.2 R99.1 U20.3(Vin) ZD5.2(C)
NetC61_2: C61.2 R100.1 U21.3(Vin) ZD6.2(C)
NetC68_2: C68.2 R104.1 U22.3(Vin) ZD7.2(C)
NetC69_2: C69.2 R105.1 U23.3(Vin) ZD8.2(C)
NetC70_2: C70.2 R106.1 U24.3(Vin) ZD9.2(C)

### Library data of the parts
C41 C43 C45 C53 C55 C57 C62 C64 C66 = Capacitor: CC0603KRX5R7BB105
C42 C44 C46 C54 C56 C58 C63 C65 C67 = Capacitor: CC0603KRX7R9BB104
C47 C51 C52 C59-C61 C68-C70 = Capacitor: CC0603KRX7R0BB102
R92-R94 R98-R100 R104-R106 = Resistor: RC0603FR-0747KL
R95 = Resistor: RC1206FR-07750RL
R96 R97 R101-R103 R107-R109 = Resistor: RC1210FR-07200RL
U16-U24 = ADC121: ADC121S021CIMF
ZD1-ZD9 = Diode Zenner: BZX384-C4V7; pin to pad: 1>2 2>1

## Sheet Encoder NPN.SchDoc
size A4
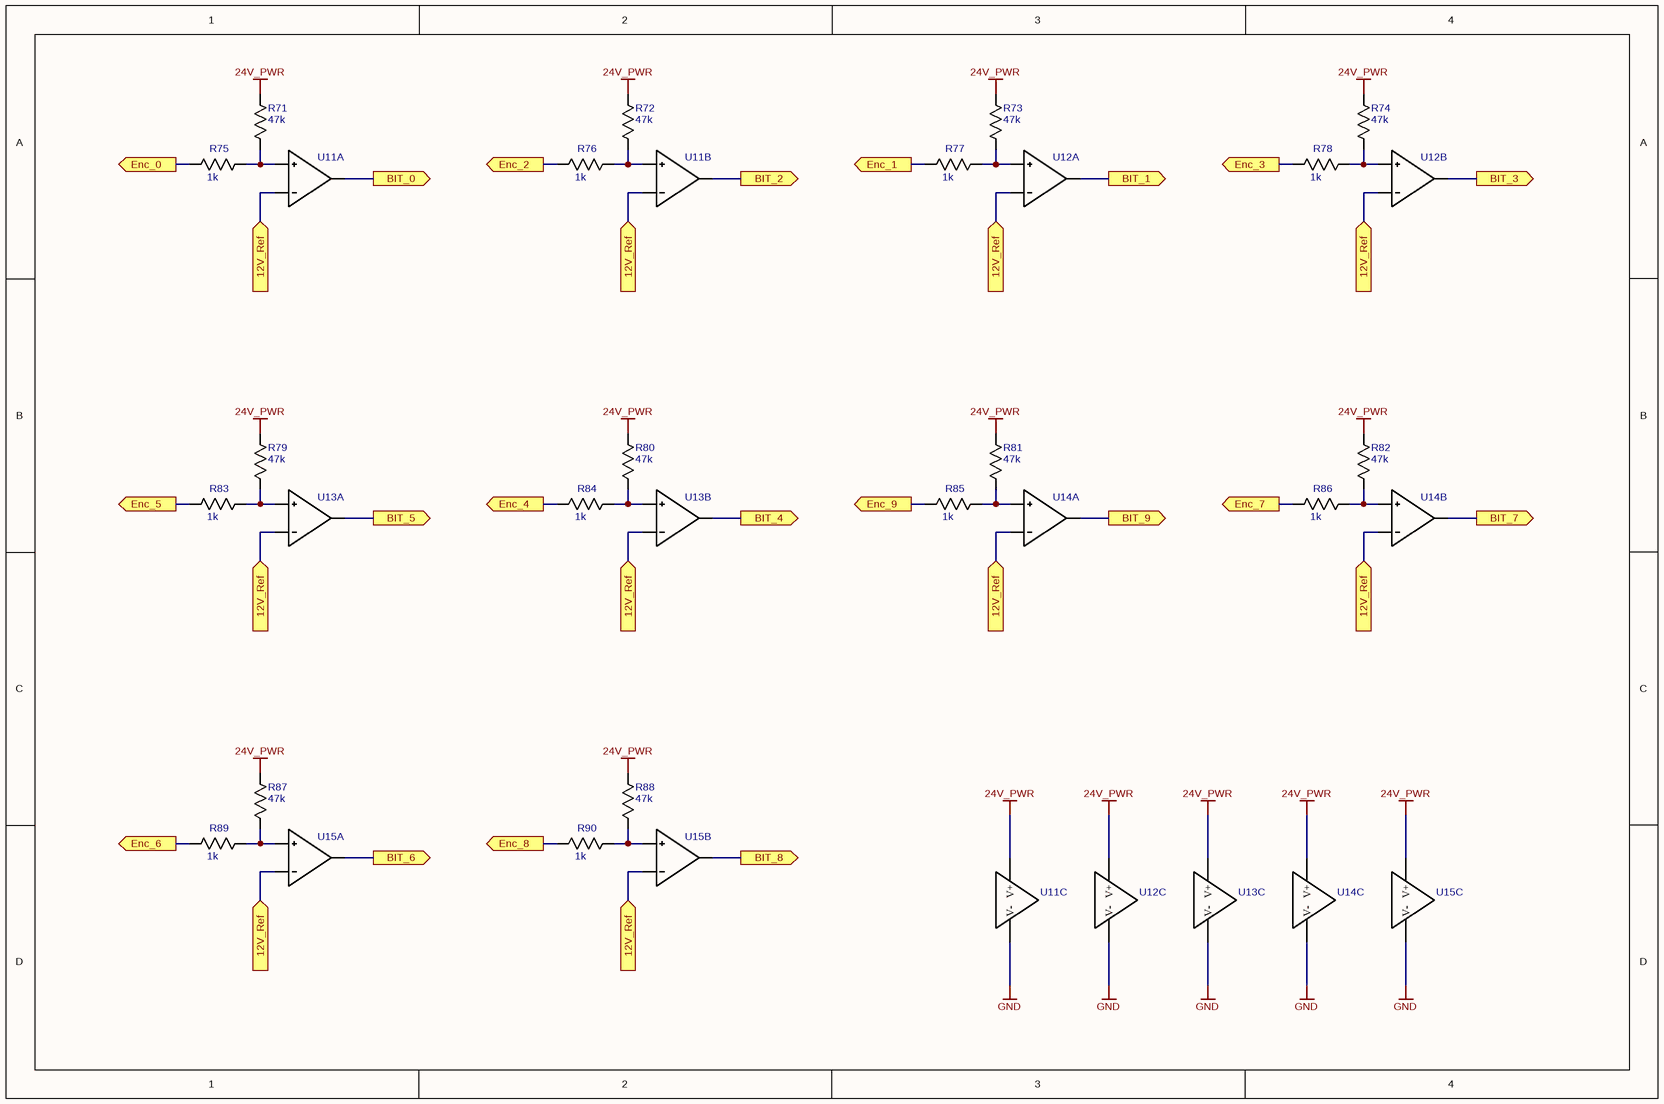
[diagram p8: Encoder NPN.SchDoc]

### Parts
R71  47k  [RES 0603]
R72  47k  [RES 0603]
R73  47k  [RES 0603]
R74  47k  [RES 0603]
R75  1k  [RES 0603]
R76  1k  [RES 0603]
R77  1k  [RES 0603]
R78  1k  [RES 0603]
R79  47k  [RES 0603]
R80  47k  [RES 0603]
R81  47k  [RES 0603]
R82  47k  [RES 0603]
R83  1k  [RES 0603]
R84  1k  [RES 0603]
R85  1k  [RES 0603]
R86  1k  [RES 0603]
R87  47k  [RES 0603]
R88  47k  [RES 0603]
R89  1k  [RES 0603]
R90  1k  [RES 0603]
U11  Comparator x2 Small  [SOIC-8]  (value not drawn)  (parts A,B,C of 3)
U12  Comparator x2 Small  (value not drawn)  (parts A,B,C of 3)
U13  Comparator x2 Small  [SOIC-8]  (value not drawn)  (parts A,B,C of 3)
U14  Comparator x2 Small  [SOIC-8]  (value not drawn)  (parts A,B,C of 3)
U15  Comparator x2 Small  (value not drawn)  (parts A,B,C of 3)

### Ports
12V_Ref, BIT_0, BIT_1, BIT_2, BIT_3, BIT_4, BIT_5, BIT_6, BIT_7, BIT_8, BIT_9, Enc_0, Enc_1, Enc_2, Enc_3, Enc_4, Enc_5, Enc_6, Enc_7, Enc_8, Enc_9

### Nets
24V_PWR: R71.2 R72.2 R73.2 R74.2 R79.2 R80.2 R81.2 R82.2 R87.2 R88.2 U11.7(V+) U12.7(V+) U13.7(V+) U14.7(V+) U15.7(V+)
GND: U11.8(V-) U12.8(V-) U13.8(V-) U14.8(V-) U15.8(V-)
12V_Ref: U11.2(-IN) U11.5(-IN) U12.2(-IN) U12.5(-IN) U13.2(-IN) U13.5(-IN) U14.2(-IN) U14.5(-IN) U15.2(-IN) U15.5(-IN) ; port 12V_Ref
BIT_0: U11.3(OUT) ; port BIT_0
BIT_1: U12.3(OUT) ; port BIT_1
BIT_2: U11.6(OUT) ; port BIT_2
BIT_3: U12.6(OUT) ; port BIT_3
BIT_4: U13.6(OUT) ; port BIT_4
BIT_5: U13.3(OUT) ; port BIT_5
BIT_6: U15.3(OUT) ; port BIT_6
BIT_7: U14.6(OUT) ; port BIT_7
BIT_8: U15.6(OUT) ; port BIT_8
BIT_9: U14.3(OUT) ; port BIT_9
Enc_0: R75.2 ; port Enc_0
Enc_1: R77.2 ; port Enc_1
Enc_2: R76.2 ; port Enc_2
Enc_3: R78.2 ; port Enc_3
Enc_4: R84.2 ; port Enc_4
Enc_5: R83.2 ; port Enc_5
Enc_6: R89.2 ; port Enc_6
Enc_7: R86.2 ; port Enc_7
Enc_8: R90.2 ; port Enc_8
Enc_9: R85.2 ; port Enc_9
NetR71_1: R71.1 R75.1 U11.1(+IN)
NetR72_1: R72.1 R76.1 U11.4(+IN)
NetR73_1: R73.1 R77.1 U12.1(+IN)
NetR74_1: R74.1 R78.1 U12.4(+IN)
NetR79_1: R79.1 R83.1 U13.1(+IN)
NetR80_1: R80.1 R84.1 U13.4(+IN)
NetR81_1: R81.1 R85.1 U14.1(+IN)
NetR82_1: R82.1 R86.1 U14.4(+IN)
NetR87_1: R87.1 R89.1 U15.1(+IN)
NetR88_1: R88.1 R90.1 U15.4(+IN)

### Library data of the parts
R71-R74 R79-R82 R87 R88 = Resistor: RC0603FR-0747KL
R75-R78 R83-R86 R89 R90 = Resistor: RC0603FR-071KL
U11 = Comparator x2 Small: LM2903; pin to pad: 1>3 3>1 4>5 5>6 6>7 7>8 8>4
U12-U15 = Comparator x2 Small: LM2903

## Sheet RS485.SchDoc
size A4
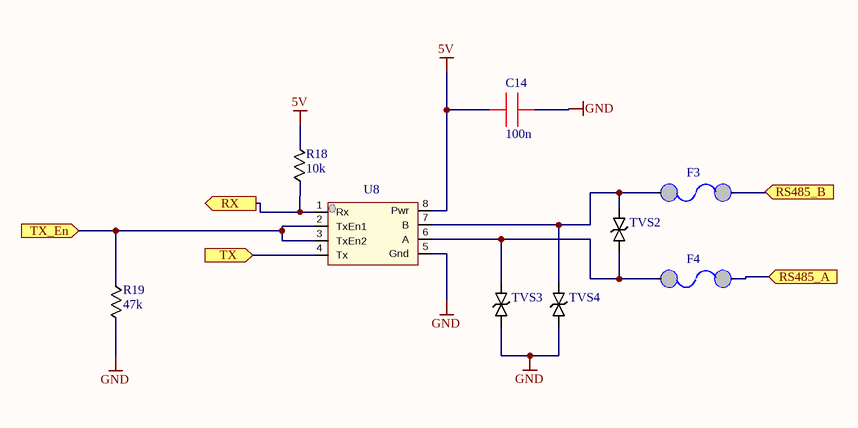
[diagram p9: RS485.SchDoc]

### Parts
C14  100n  [0603]
F3  Resettable FUSE  [1210]  (value not drawn)
F4  Resettable FUSE  [1210]  (value not drawn)
R18  10k  [0603]
R19  47k  [0603]
TVS2  TVS 6V  [DO-214AC]  (value not drawn)
TVS3  TVS 6V  [DO-214AC]  (value not drawn)
TVS4  TVS 6V  [DO-214AC]  (value not drawn)
U8  RS485 Driver  [SOIC 8]  (value not drawn)

### Ports
RS485_A, RS485_B, RX, TX, TX_En

### Nets
5V: C14.1 R18.2 U8.8(Pwr)
GND: C14.2 R19.2 TVS3.1 TVS4.1 U8.5(Gnd)
RS485_A: F4.1 ; port RS485_A
RS485_B: F3.1 ; port RS485_B
RX: R18.1 U8.1(Rx) ; port RX
TX: U8.4(Tx) ; port TX
TX_En: R19.1 U8.2(TxEn1) U8.3(TxEn2) ; port TX_En
NetF3_2: F3.2 TVS2.2 TVS4.2 U8.7(B)
NetF4_2: F4.2 TVS2.1 TVS3.2 U8.6(A)

### Library data of the parts
C14 = 0603 CAP: CC0603KRX7R9BB104
F3 F4 = Fuse PTS: MF-USMF005-2
R18 = 0603 RES: RC0603FR-0710KL
R19 = 0603 RES: RC0603FR-0747KL
TVS2-TVS4 = TVS: SMAJ6.0CA
U8 = MAX485: SN65HVD3082EDR

## Sheet Ethernet.SchDoc
size A3
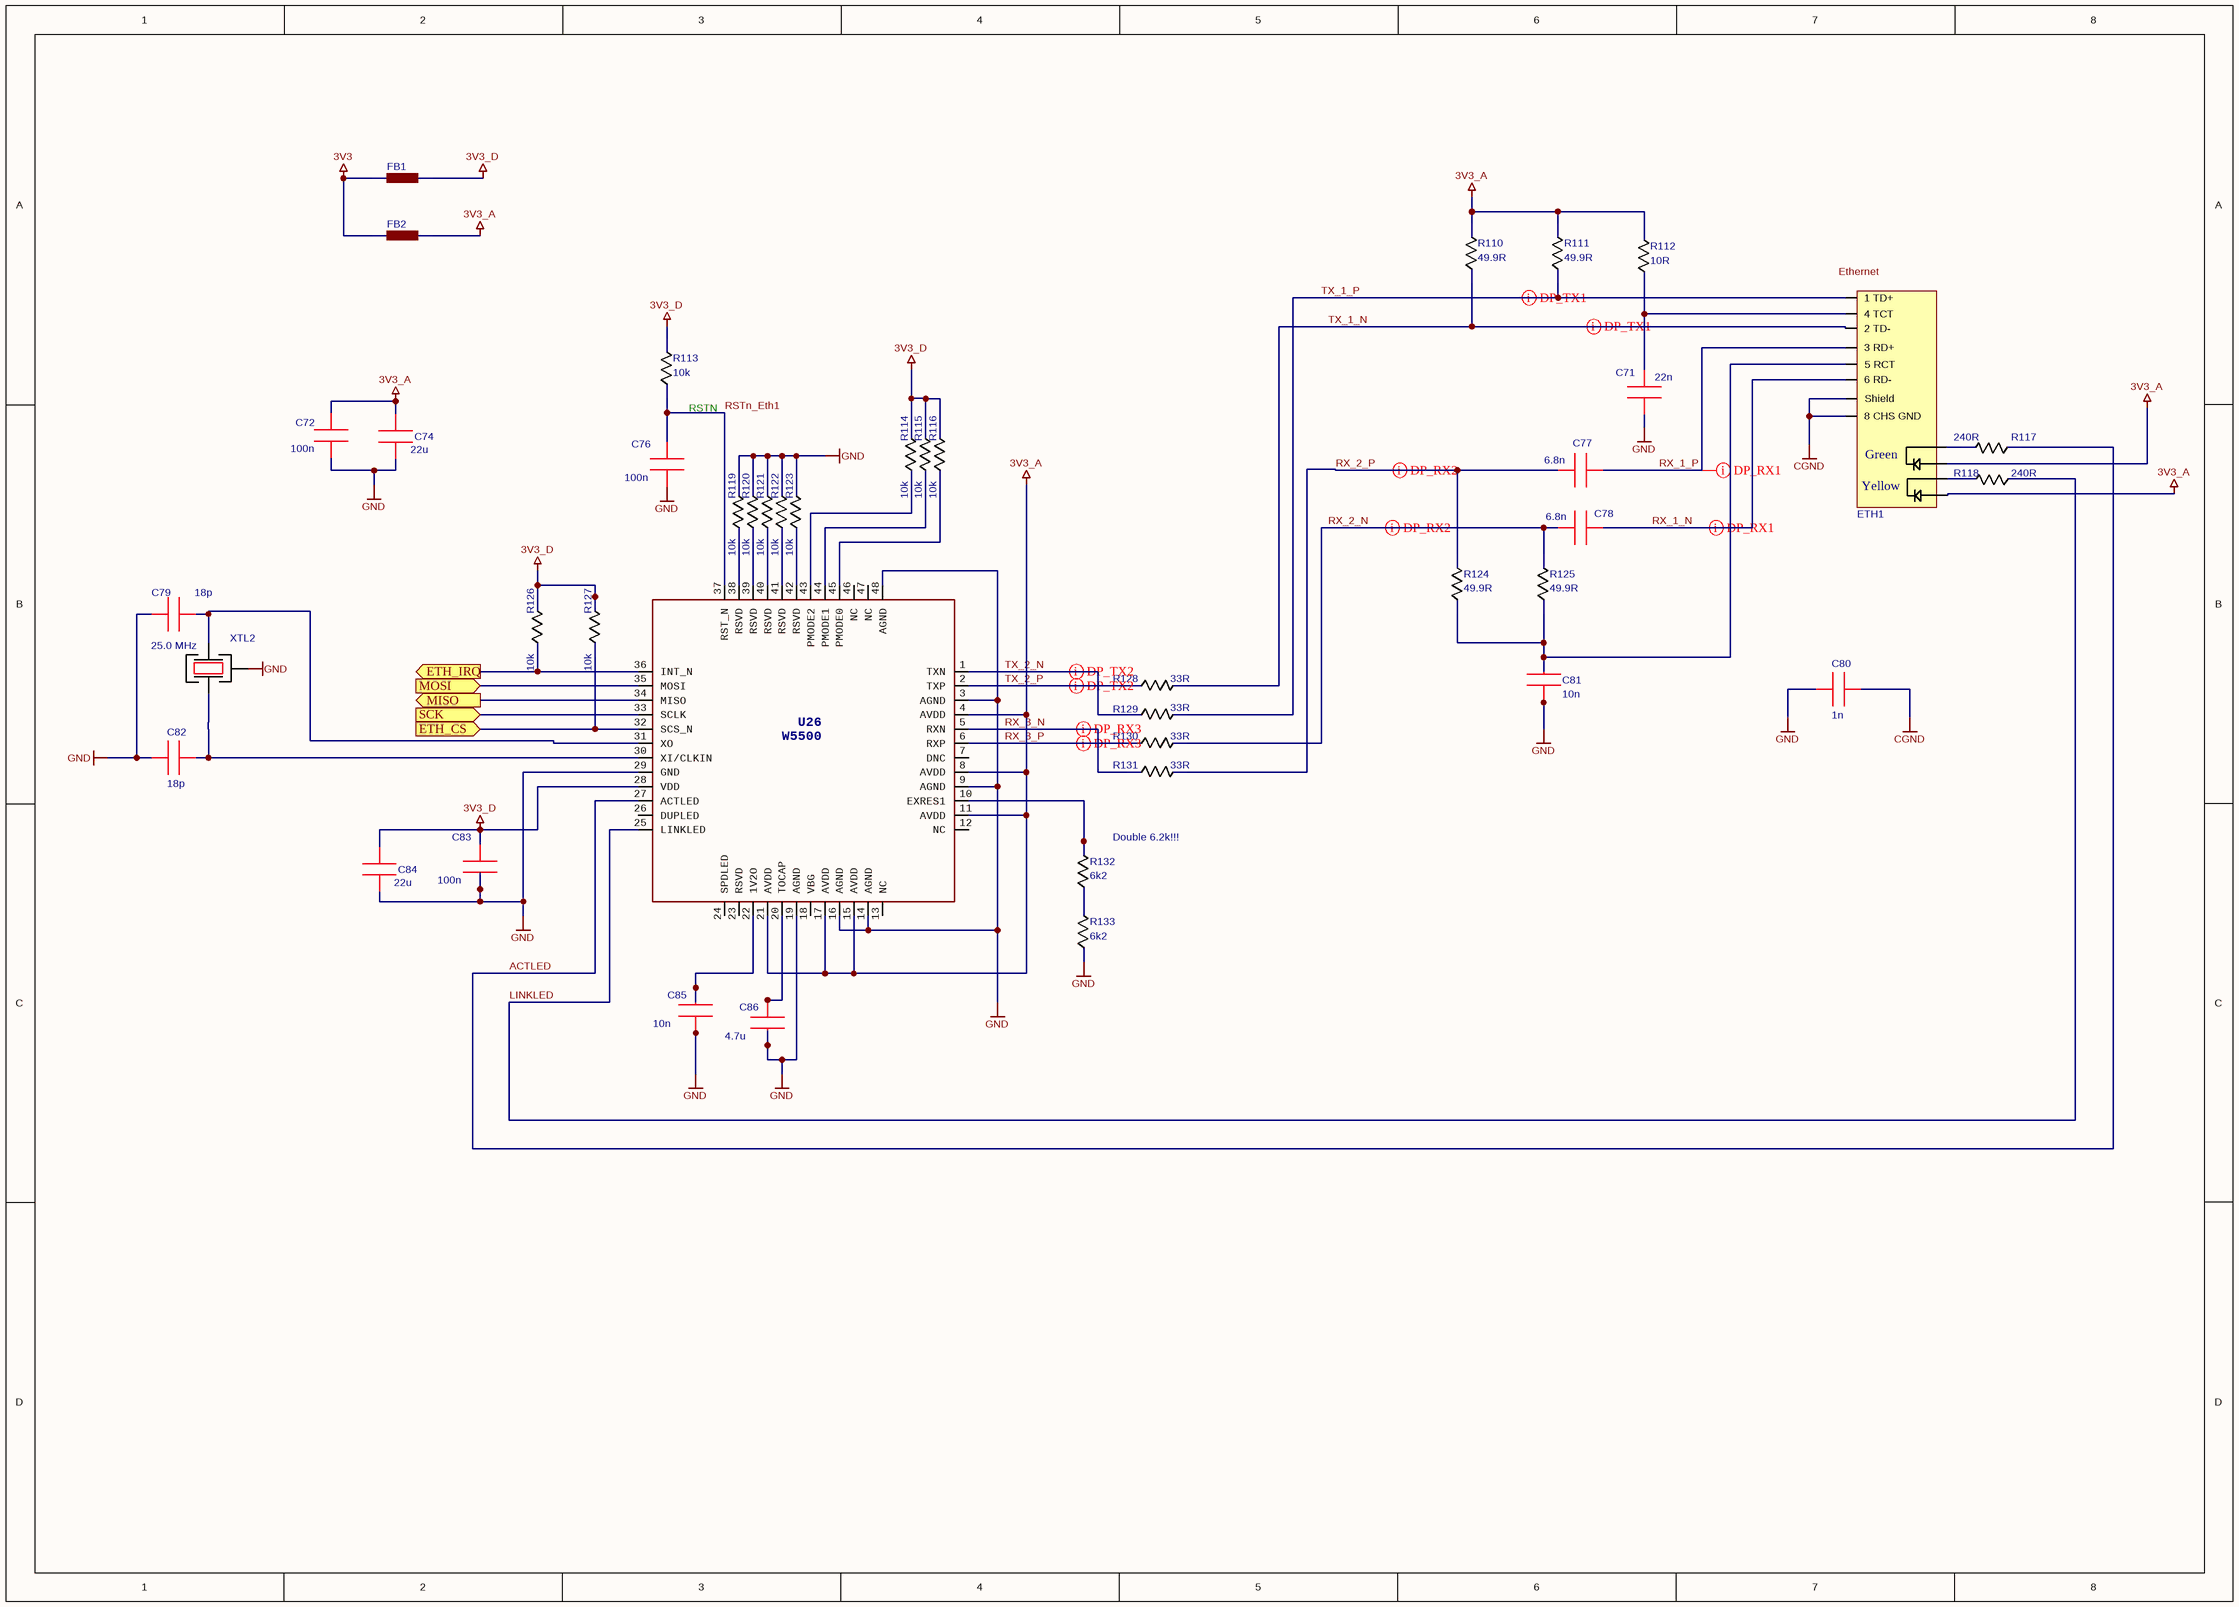
[diagram p10: Ethernet.SchDoc]

### Parts
C71  22n  [0603]
C72  100n  [0603]
C74  22u  [1206]
C76  100n  [0603]
C77  6.8n  [0603]
C78  6.8n  [0603]
C79  18p  [0603]
C80  1n  [1206]
C81  10n  [0603]
C82  18p  [0603]
C83  100n  [0603]
C84  22u  [1206]
C85  10n  [0603]
C86  4.7u  [0603]
ETH1  Ethernet RJ-45 Port  [J011D21BNL]  (value not drawn)
FB1  Ferrite Bead  [0805]  (value not drawn)
FB2  Ferrite Bead  [0805]  (value not drawn)
R110  49.9R  [0603]
R111  49.9R  [0603]
R112  10R  [0603]
R113  10k  [0603]
R114  10k  [0603]
R115  10k  [0603]
R116  10k  [0603]
R117  240R  [0603]
R118  240R  [0603]
R119  10k  [0603]
R120  10k  [0603]
R121  10k  [0603]
R122  10k  [0603]
R123  10k  [0603]
R124  49.9R  [0603]
R125  49.9R  [0603]
R126  10k  [0603]
R127  10k  [0603]
R128  33R  [0603]
R129  33R  [0603]
R130  33R  [0603]
R131  33R  [0603]
R132  6k2  [0603]
R133  6k2  [0603]
U26  W5500  [LQFP 48]
XTL2  25.0 MHz  [KX-7 XTAL]

### Ports
ETH_CS, ETH_IRQ, MISO, MOSI, SCK

### Nets
3V3: FB1.1 FB2.1
3V3_A: C72.1 C74.2 ETH1.9(LDGr) ETH1.12(LDYE) FB2.2 R110.2 R111.2 R112.2 U26.4(AVDD) U26.8(AVDD) U26.11(AVDD) U26.15(AVDD) U26.17(AVDD) U26.21(AVDD)
3V3_D: C83.1 C84.2 FB1.2 R113.2 R114.2 R115.2 R116.2 R126.2 R127.2 U26.28(VDD)
CGND: C80.2 ETH1.8(8_CHS_GND) ETH1.SHIELD(Shield)
GND: C71.2 C72.2 C74.1 C76.2 C79.1 C80.1 C81.2 C82.1 C83.2 C84.1 C85.2 C86.2 R119.2 R120.2 R121.2 R122.2 R123.2 R133.1 U26.3(AGND) U26.9(AGND) U26.14(AGND) U26.16(AGND) U26.19(AGND) U26.29(GND) U26.48(AGND) XTL2.2
ACTLED: R117.1 U26.27(ACTLED)
ETH_CS: R127.1 U26.32(SCS_N) ; port ETH_CS
ETH_IRQ: R126.1 U26.36(INT_N) ; port ETH_IRQ
LINKLED: R118.1 U26.25(LINKLED)
MISO: U26.34(MISO) ; port MISO
MOSI: U26.35(MOSI) ; port MOSI
RSTn_Eth1: C76.1 R113.1 U26.37(RST_N)
RX_1_N: C78.2 ETH1.6(6_RD-)
RX_1_P: C77.2 ETH1.3(3_RD+)
RX_2_N: C78.1 R125.2 R130.2
RX_2_P: C77.1 R124.2 R131.2
RX_3_N: R131.1 U26.5(RXN)
RX_3_P: R130.1 U26.6(RXP)
SCK: U26.33(SCLK) ; port SCK
TX_1_N: ETH1.2(2_TD-) R110.1 R128.2
TX_1_P: ETH1.1(1_TD+) R111.1 R129.2
TX_2_N: R129.1 U26.1(TXN)
TX_2_P: R128.1 U26.2(TXP)
NetC71_1: C71.1 ETH1.4(4_TCT) R112.1
NetC79_2: C79.2 U26.31(XO) XTL2.3
NetC81_1: C81.1 ETH1.5(5_RCT) R124.1 R125.1
NetC82_2: C82.2 U26.30(XI/CLKIN) XTL2.1
NetC85_1: C85.1 U26.22(1V2O)
NetC86_1: C86.1 U26.20(TOCAP)
NetETH1_10: ETH1.10(LDGr) R117.2
NetETH1_11: ETH1.11(LDYE) R118.2
NetR114_1: R114.1 U26.43(PMODE2)
NetR115_1: R115.1 U26.44(PMODE1)
NetR116_1: R116.1 U26.45(PMODE0)
NetR119_1: R119.1 U26.38(RSVD)
NetR120_1: R120.1 U26.39(RSVD)
NetR121_1: R121.1 U26.40(RSVD)
NetR122_1: R122.1 U26.41(RSVD)
NetR123_1: R123.1 U26.42(RSVD)
NetR132_1: R132.1 R133.2
NetR132_2: R132.2 U26.10(EXRES1)

Not connected (* = marked no-connect by the designer): U26 7(DNC) 12(NC) 13(NC) 18(VBG) 23(RSVD) 24(SPDLED) 26(DUPLED) 46(NC) 47(NC)

### Layout directives
differential pair: RX_1_N, RX_1_P, RX_2_N, RX_2_P, RX_3_N, RX_3_P, TX_1_N, TX_1_P, TX_2_N, TX_2_P

### Notes on the sheet
- (near ETH1) Ethernet
- (near R113) RSTN
- (near R132) Double 6.2k!!!
- (in symbol J0011D21BNL) Green; Yellow

### Library data of the parts
C71 = 0603 CAP: GRM188R71H223KA01D
C72 C76 C83 = 0603 CAP: CC0603KRX7R9BB104
C74 C84 = 0805 Cap: CC1206KKX5R8BB226
C77 C78 = 0603 CAP: CC0603KRX7R9BB682
C79 C82 = 0603 CAP: CC0603JRNPO9BN180
C80 = 0603 CAP: CC1206KKX7RDBB102
C81 C85 = 0603 CAP: CC0603JRX7R9BB103
C86 = 0603 CAP: GRM188R61A475KE15D
ETH1 = J0011D21BNL
FB1 FB2 = BLM21PG220SN1D
R110 R111 R124 R125 = 0603 RES: RC0603FR-0749R9
R112 = 0603 RES: RC0603FR-0710RL
R113-R116 R119-R123 R126 R127 = 0603 RES: RC0603FR-0710KL
R117 R118 = 0603 RES: RC0603FR-07240RL
R128-R131 = 0603 RES: RC0603FR-0733R
R132 R133 = 0603 RES: RC0603FR-076K2
XTL2 = KX-7: 12.88711

## Sheet LEDs.SchDoc
size A4
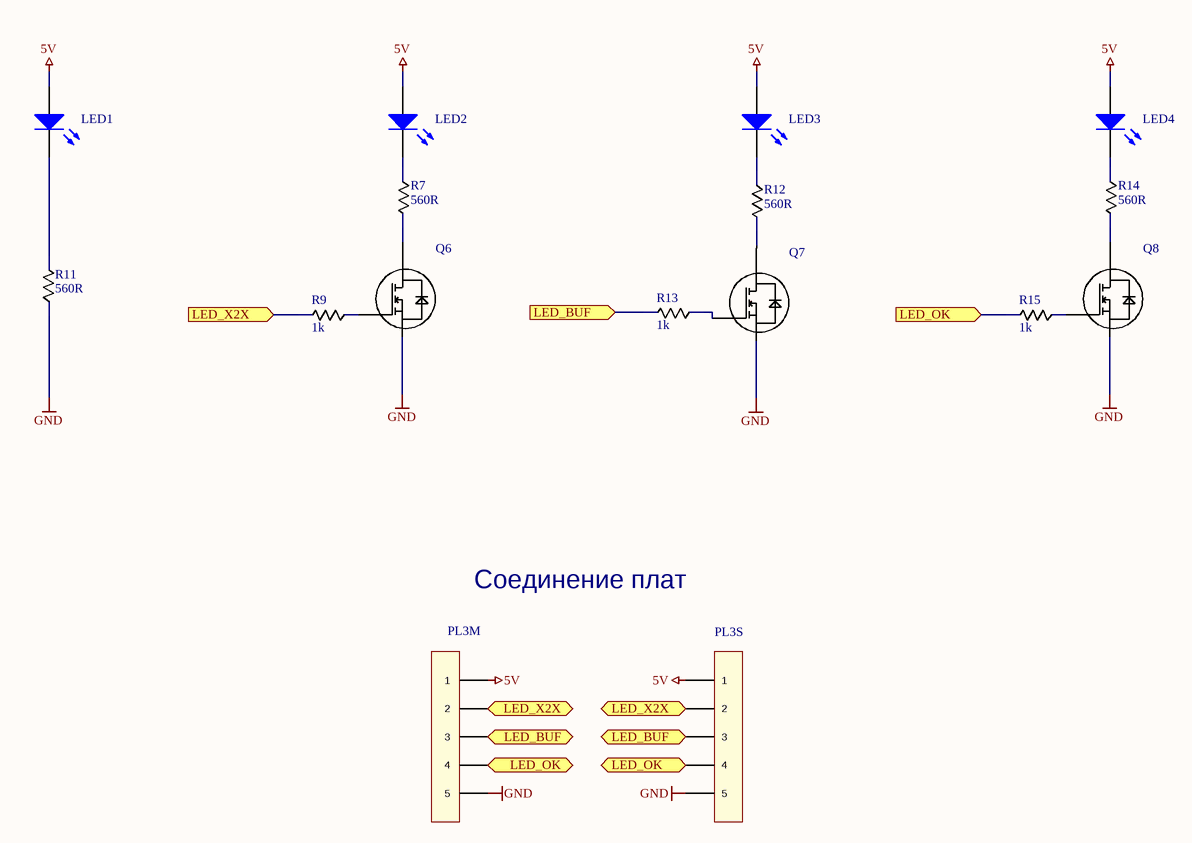
[diagram p11: LEDs.SchDoc]

### Parts
LED1  LED Green  [0603]  (value not drawn)
LED2  LED Green  [0603]  (value not drawn)
LED3  LED Green  [0603]  (value not drawn)
LED4  LED Green  [0603]  (value not drawn)
PL3M  Pin Line  [PLS-5 2.54]  (value not drawn)
PL3S  Pin Line  [PLS-5 2.54]  (value not drawn)
Q6  MOSFET-N  [SOT23]  (value not drawn)
Q7  MOSFET-N  [SOT23]  (value not drawn)
Q8  MOSFET-N  [SOT23]  (value not drawn)
R7  560R  [0603]
R9  1k  [0603]
R11  560R  [0603]
R12  560R  [0603]
R13  1k  [0603]
R14  560R  [0603]
R15  1k  [0603]

### Ports
LED_BUF, LED_OK, LED_X2X

### Nets
5V: LED1.1(A) LED2.1(A) LED3.1(A) LED4.1(A) PL3M.1 PL3S.1
GND: PL3M.5 PL3S.5 Q6.2(S) Q7.2(S) Q8.2(S) R11.1
LED_BUF: PL3M.3 PL3S.3 R13.2 ; port LED_BUF
LED_OK: PL3M.4 PL3S.4 R15.2 ; port LED_OK
LED_X2X: PL3M.2 PL3S.2 R9.2 ; port LED_X2X
NetLED1_2: LED1.2(K) R11.2
NetLED2_2: LED2.2(K) R7.1
NetLED3_2: LED3.2(K) R12.1
NetLED4_2: LED4.2(K) R14.1
NetQ6_1: Q6.1(G) R9.1
NetQ6_3: Q6.3(D) R7.2
NetQ7_1: Q7.1(G) R13.1
NetQ7_3: Q7.3(D) R12.2
NetQ8_1: Q8.1(G) R15.1
NetQ8_3: Q8.3(D) R14.2

### Notes on the sheet
- Соединение плат

### Library data of the parts
LED1-LED4 = 0603 LED: KP-1608SGC; Published: 8-Jun-2000; LatestRevisionDate: 08-Jul-2005; LatestRevisionNote: Mech Layer 1 removed.; PackageReference: LED-0; Publisher: Altium Limited; PackageDescription: LED; 2 Leads
PL3M PL3S = PLS-5: PLS-5 2.54
Q6-Q8 = BSS138: IRLML2502TR
R7 R11 R12 R14 = 0603 RES: RC0603JR-07560RL
R9 R13 R15 = 0603 RES: RC0603FR-071KL

## Sheet Plugs.SchDoc
size A4
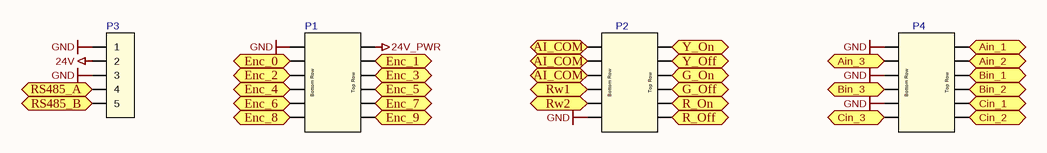
[diagram p12: Plugs.SchDoc]

### Parts
P1  Conncector 6x2  [Connector 6x2]  (value not drawn)
P2  Conncector 6x2  [Connector 6x2]  (value not drawn)
P3  Conncector X2X  [Connector X2X]  (value not drawn)
P4  Conncector 6x2  [Connector 6x2]  (value not drawn)

### Ports
AI_COM, Ain_1, Ain_2, Ain_3, Bin_1, Bin_2, Bin_3, Cin_1, Cin_2, Cin_3, Enc_0, Enc_1, Enc_2, Enc_3, Enc_4, Enc_5, Enc_6, Enc_7, Enc_8, Enc_9, G_Off, G_On, R_Off, R_On, RS485_A, RS485_B, Rw1, Rw2, Y_Off, Y_On

### Nets
24V: P3.2
24V_PWR: P1.2
GND: P1.1 P2.11 P3.1 P3.3 P4.1 P4.5 P4.9
AI_COM: P2.1 P2.3 P2.5 ; port AI_COM
Ain_1: P4.2 ; port Ain_1
Ain_2: P4.4 ; port Ain_2
Ain_3: P4.3 ; port Ain_3
Bin_1: P4.6 ; port Bin_1
Bin_2: P4.8 ; port Bin_2
Bin_3: P4.7 ; port Bin_3
Cin_1: P4.10 ; port Cin_1
Cin_2: P4.12 ; port Cin_2
Cin_3: P4.11 ; port Cin_3
Enc_0: P1.3 ; port Enc_0
Enc_1: P1.4 ; port Enc_1
Enc_2: P1.5 ; port Enc_2
Enc_3: P1.6 ; port Enc_3
Enc_4: P1.7 ; port Enc_4
Enc_5: P1.8 ; port Enc_5
Enc_6: P1.9 ; port Enc_6
Enc_7: P1.10 ; port Enc_7
Enc_8: P1.11 ; port Enc_8
Enc_9: P1.12 ; port Enc_9
G_Off: P2.8 ; port G_Off
G_On: P2.6 ; port G_On
R_Off: P2.12 ; port R_Off
R_On: P2.10 ; port R_On
RS485_A: P3.4 ; port RS485_A
RS485_B: P3.5 ; port RS485_B
Rw1: P2.7 ; port Rw1
Rw2: P2.9 ; port Rw2
Y_Off: P2.4 ; port Y_Off
Y_On: P2.2 ; port Y_On

### Notes on the sheet
- (in symbol Conncector 6x2) Bottom Row; Top Row

### Library data of the parts
P1 P2 P4 = Conncector 6x2: MCD 1,5/6-G1-3,81 PCB Connector
P3 = Connector X2X: EMSTBA 2,5/ 5-G-5,08 PCB Connector

## Nets that join several sheets
3V3: PSU (C9.1 C10.1 U3.5), Ethernet (FB1.1 FB2.1)
5V: PSU (C7.2 C11.1 C12.1 U4.2), MCU (8 pins), FRAM (5 pins), RTC (R152.2 R153.2 U30.8), CT Main (21 pins), DI 220V DC (6 pins), PT100 (8 pins), 4-20 (27 pins), RS485 (C14.1 R18.2 U8.8), LEDs (6 pins)
24V: PSU (F1.2 F2.2), Plugs (P3.2)
24V_PWR: PSU (D1.1 R5.1), Encoder NPN (15 pins), Plugs (P1.2)
GND: PSU (20 pins), MCU (17 pins), FRAM (C97.2 U27.4), RTC (C94.1 C95.1 U30.4), CT Main (30 pins), DI 220V DC (6 pins), PT100 (12 pins), 4-20 (54 pins), Encoder NPN (5 pins), RS485 (5 pins), Ethernet (26 pins), LEDs (6 pins), Plugs (7 pins)
12V_Ref: PSU (R5.2 R8.1), Encoder NPN (10 pins)
ADC_A1: MCU (J1.4 U25.2), 4-20 (U16.5)
ADC_A2: MCU (J1.1 U25.3), 4-20 (U17.5)
ADC_A3: MCU (U25.4), 4-20 (U18.5)
ADC_A4: MCU (U25.5), 4-20 (U19.5)
ADC_A5: MCU (U25.6), 4-20 (U20.5)
ADC_A6: MCU (U25.7), 4-20 (U21.5)
ADC_A7: MCU (U25.8), 4-20 (U22.5)
ADC_A8: MCU (U25.9), 4-20 (U23.5)
ADC_A9: MCU (U25.58), 4-20 (U24.5)
ADC_CLK: MCU (U25.31), CT Main (5 pins), PT100 (U29.4), 4-20 (9 pins)
ADC_CS: MCU (U25.30), CT Main (5 pins), PT100 (U29.6), 4-20 (9 pins)
ADC_CT1: MCU (U25.61), CT Main (PL2M.1 PL2S.1 U2.5)
ADC_CT1_GAIN: MCU (U25.56), CT Main (PL2M.2 PL2S.2 R28.1)
ADC_CT2: MCU (U25.60), CT Main (PL1M.2 PL1S.2 U5.5)
ADC_CT2_GAIN: MCU (U25.55), CT Main (PL1M.3 PL1S.3 R29.1)
ADC_CT3: MCU (U25.59), CT Main (PL1M.4 PL1S.4 U9.5)
ADC_CT3_GAIN: MCU (U25.54), CT Main (PL1M.5 PL1S.5 R39.1)
ADC_PT100: MCU (U25.57), PT100 (U29.5)
AI_COM: DI 220V DC (18 pins), Plugs (P2.1 P2.3 P2.5)
Ain_1: 4-20 (R92.2 R95.2), Plugs (P4.2)
Ain_2: 4-20 (R93.2 R96.2), Plugs (P4.4)
Ain_3: 4-20 (R94.2 R97.2), Plugs (P4.3)
Bin_1: 4-20 (R98.2 R101.2), Plugs (P4.6)
Bin_2: 4-20 (R99.2 R102.2), Plugs (P4.8)
Bin_3: 4-20 (R100.2 R103.2), Plugs (P4.7)
BIT_0: MCU (U25.35), Encoder NPN (U11.3)
BIT_1: MCU (U25.36), Encoder NPN (U12.3)
BIT_2: MCU (U25.37), Encoder NPN (U11.6)
BIT_3: MCU (U25.38), Encoder NPN (U12.6)
BIT_4: MCU (U25.39), Encoder NPN (U13.6)
BIT_5: MCU (U25.40), Encoder NPN (U13.3)
BIT_6: MCU (U25.41), Encoder NPN (U15.3)
BIT_7: MCU (U25.42), Encoder NPN (U14.6)
BIT_8: MCU (U25.45), Encoder NPN (U15.6)
BIT_9: MCU (U25.44), Encoder NPN (U14.3)
Cin_1: 4-20 (R104.2 R107.2), Plugs (P4.10)
Cin_2: 4-20 (R105.2 R108.2), Plugs (P4.12)
Cin_3: 4-20 (R106.2 R109.2), Plugs (P4.11)
DI_01: MCU (U25.51), DI 220V DC (R41.1 U*1.Collector)
DI_02: MCU (U25.50), DI 220V DC (R42.1 U*2.Collector)
DI_03: MCU (U25.49), DI 220V DC (R51.1 U*3.Collector)
DI_04: MCU (U25.48), DI 220V DC (R52.1 U*4.Collector)
DI_05: MCU (U25.47), DI 220V DC (R61.1 U*5.Collector)
DI_06: MCU (U25.46), DI 220V DC (R62.1 U*6.Collector)
Enc_0: Encoder NPN (R75.2), Plugs (P1.3)
Enc_1: Encoder NPN (R77.2), Plugs (P1.4)
Enc_2: Encoder NPN (R76.2), Plugs (P1.5)
Enc_3: Encoder NPN (R78.2), Plugs (P1.6)
Enc_4: Encoder NPN (R84.2), Plugs (P1.7)
Enc_5: Encoder NPN (R83.2), Plugs (P1.8)
Enc_6: Encoder NPN (R89.2), Plugs (P1.9)
Enc_7: Encoder NPN (R86.2), Plugs (P1.10)
Enc_8: Encoder NPN (R90.2), Plugs (P1.11)
Enc_9: Encoder NPN (R85.2), Plugs (P1.12)
ETH_CS: MCU (U25.10), Ethernet (R127.1 U26.32)
ETH_IRQ: MCU (U25.32), Ethernet (R126.1 U26.36)
FRAM_CS: MCU (U25.14), FRAM (R134.1 U27.1)
G_Off: DI 220V DC (R58.1), Plugs (P2.8)
G_On: DI 220V DC (R54.1), Plugs (P2.6)
LED_BUF: MCU (U25.17), LEDs (PL3M.3 PL3S.3 R13.2)
LED_OK: MCU (U25.15), LEDs (PL3M.4 PL3S.4 R15.2)
LED_X2X: MCU (U25.16), LEDs (PL3M.2 PL3S.2 R9.2)
MISO: MCU (U25.13), FRAM (U27.2), Ethernet (U26.34)
MOSI: MCU (U25.12), FRAM (U27.5), Ethernet (U26.35)
R_Off: DI 220V DC (R68.1), Plugs (P2.12)
R_On: DI 220V DC (R64.1), Plugs (P2.10)
RS485_A: RS485 (F4.1), Plugs (P3.4)
RS485_B: RS485 (F3.1), Plugs (P3.5)
Rw1: PT100 (R140.1 R145.1 U28.4), Plugs (P2.7)
Rw2: PT100 (R149.1), Plugs (P2.9)
RX: MCU (U25.27), RS485 (R18.1 U8.1)
SCK: MCU (J1.3 U25.11), FRAM (U27.6), Ethernet (U26.33)
SCL: MCU (U25.25), RTC (R152.1 U30.6)
SDA: MCU (U25.26), RTC (R153.1 U30.5)
TX: MCU (U25.28), RS485 (U8.4)
TX_En: MCU (U25.29), RS485 (R19.1 U8.2 U8.3)
Y_Off: DI 220V DC (R48.1), Plugs (P2.4)
Y_On: DI 220V DC (R44.1), Plugs (P2.2)